# Altium project balenaFin_v1_x_x.PrjPcb (part 2 of 3)

## Sheet 05 - USB.SchDoc
size 420 x 297 mm
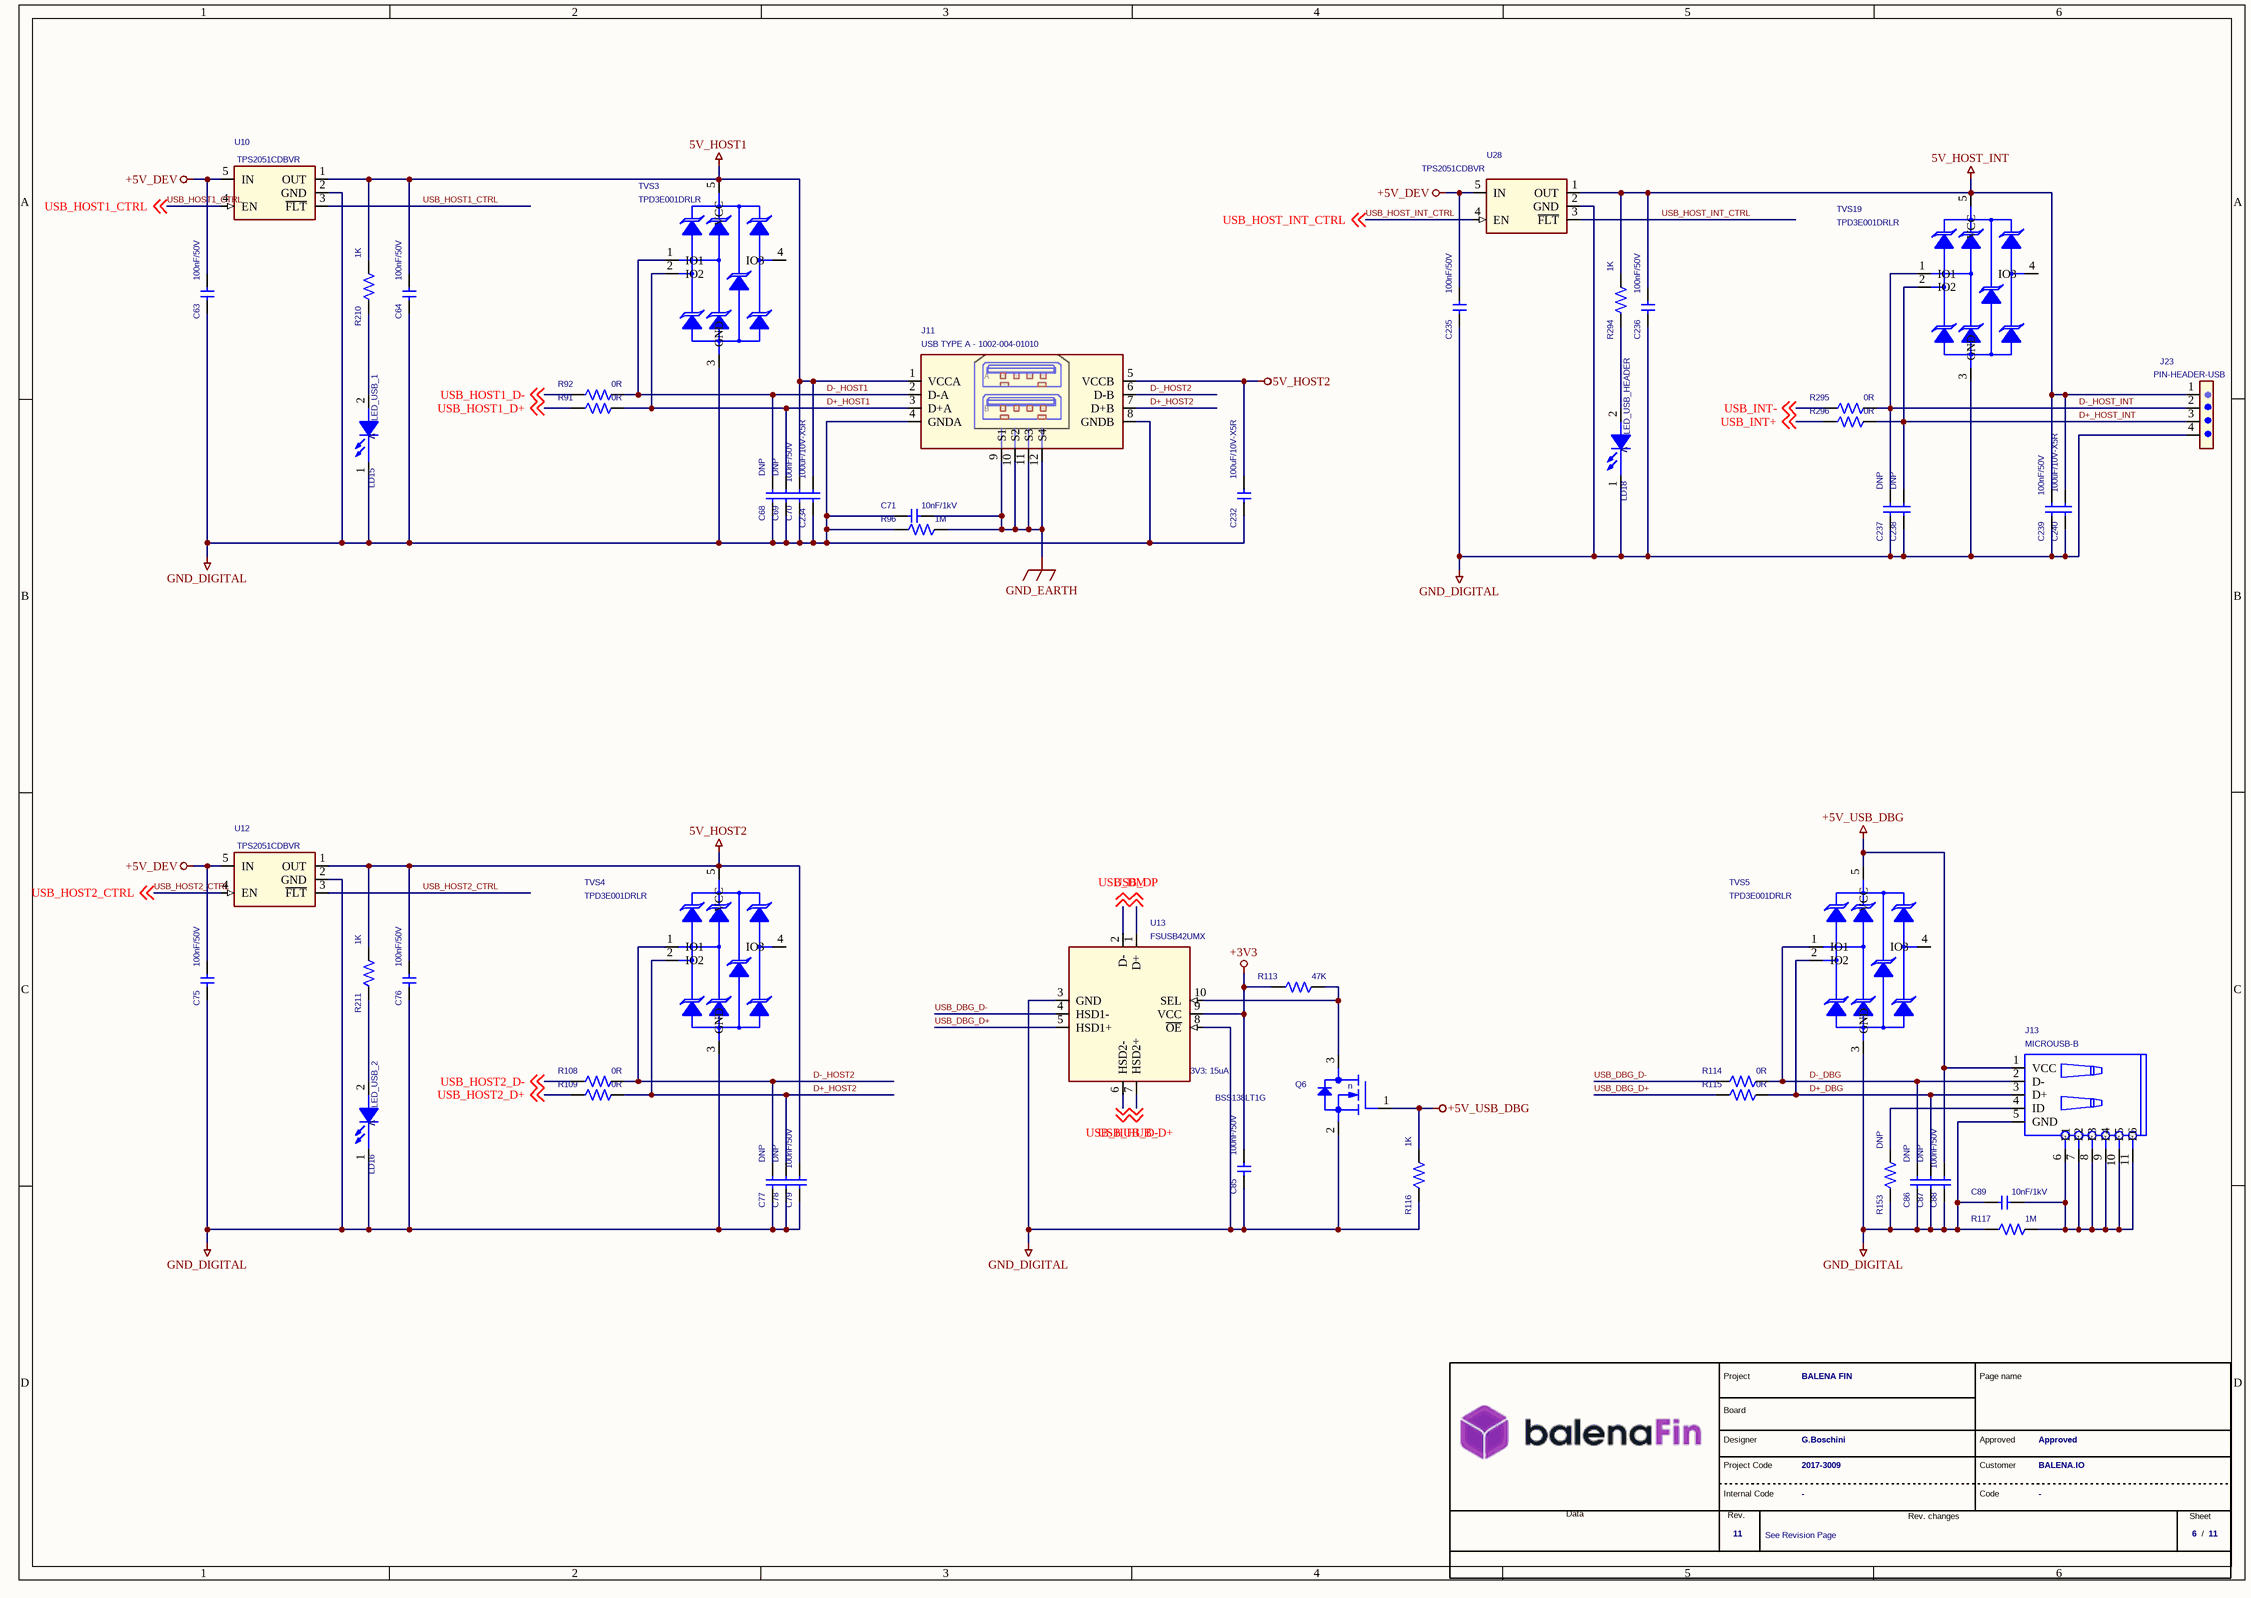
[diagram p7: 05 - USB.SchDoc]

### Parts
(Parts that share a designator on the sheet are numbered #1, #2 ... from top to bottom, then left to right.)
*#5  Revision: 11  FAE RD code: 2017-3009  DocumentoRev: See Revision Page  Page Number: 6  Nome Progetto: BALENA FIN  Customer name: BALENA.IO  Project manager: Approved  Project designer: G.Boschini  (hidden comment: MyFAEVuoto)  (graphical)
C63  100nF/50V  [CS-C-0402]
C64  100nF/50V  [CS-C-0402]
C68  DNP  [CS-C-0402]
C69  DNP  [CS-C-0402]
C70  100nF/50V  [CS-C-0402]
C71  10nF/1kV  [CS-C-1206]
C75  100nF/50V  [CS-C-0402]
C76  100nF/50V  [CS-C-0402]
C77  DNP  [CS-C-0402]
C78  DNP  [CS-C-0402]
C79  100nF/50V  [CS-C-0402]
C85  100nF/50V  [CS-C-0402]
C86  DNP  [CS-C-0402]
C87  DNP  [CS-C-0402]
C88  100nF/50V  [CS-C-0402]
C89  10nF/1kV  [CS-C-1206]
C232  100uF/10V-X5R  [CS-C-1210]
C234  100uF/10V-X5R  [CS-C-1210]
C235  100nF/50V  [CS-C-0402]
C236  100nF/50V  [CS-C-0402]
C237  DNP  [CS-C-0402]
C238  DNP  [CS-C-0402]
C239  100nF/50V  [CS-C-0402]
C240  100uF/10V-X5R  [CS-C-1210]
J11  USB TYPE A - 1002-004-01010  [J-8-0200-FOT-USB-A-2X]
J13  MICROUSB-B  [J-5-0065-FOS-MICROUSB10118192]
J23  PIN-HEADER-USB  [J-4-0254-MDT]
LD15  LED_USB_1  [LD-0603]
LD16  LED_USB_2  [LD-0603]
LD18  LED_USB_HEADER  [LD-0603]
Q6  BSS138LT1G  [SOT23]
R91  0R  [RS-0402]
R92  0R  [RS-0402]
R96  1M  [RS-1206]
R108  0R  [RS-0402]
R109  0R  [RS-0402]
R113  47K  [RS-0402]
R114  0R  [RS-0402]
R115  0R  [RS-0402]
R116  1K  [RS-0402]
R117  1M  [RS-1206]
R153  DNP  [RS-0402]
R210  1K  [RS-0402]
R211  1K  [RS-0402]
R294  1K  [RS-0402]
R295  0R  [RS-0402]
R296  0R  [RS-0402]
TVS3  TPD3E001DRLR  [SOP5_USON6]
TVS4  TPD3E001DRLR  [SOP5_USON6]
TVS5  TPD3E001DRLR  [SOP5_USON6]
TVS19  TPD3E001DRLR  [SOP5_USON6]
U10  TPS2051CDBVR  [SOT23-5]
U12  TPS2051CDBVR  [SOT23-5]
U13  FSUSB42UMX  Power requirements: 3V3: 15uA  [UMLP10]
U28  TPS2051CDBVR  [SOT23-5]

### Nets
5V_HOST1: C64.1 C70.1 C234.1 J11.1(VCCA) R210.2 TVS3.5(VCC) U10.1(OUT)
5V_HOST2: C76.1 C79.1 C232.1 J11.5(VCCB) R211.2 TVS4.5(VCC) U12.1(OUT)
5V_HOST_INT: C236.1 C239.1 C240.1 J23.1 R294.2 TVS19.5(VCC) U28.1(OUT)
+3V3: C85.1 R113.1 U13.9(VCC)
+5V_DEV: C63.1 C75.1 C235.1 U10.5(IN) U12.5(IN) U28.5(IN)
+5V_USB_DBG: C88.1 J13.1(VCC) Q6.1(G) R116.2 TVS5.5(VCC)
GND_DIGITAL: C63.2 C64.2 C68.2 C69.2 C70.2 C71.1 C75.2 C76.2 C77.2 C78.2 C79.2 C85.2 C86.2 C87.2 C88.2 C89.1 C232.2 C234.2 C235.2 C236.2 C237.2 C238.2 C239.2 C240.2 J11.4(GNDA) J11.8(GNDB) J13.5(GND) J23.4 LD15.1(C) LD16.1(C) LD18.1(C) Q6.2(S) R96.1 R116.1 R117.1 R153.1 TVS3.3(GND) TVS4.3(GND) TVS5.3(GND) TVS19.3(GND) U10.2(GND) U12.2(GND) U13.3(GND) U13.8(~{OE}) U28.2(GND)
GND_EARTH: C71.2 J11.9(S1) J11.10(S2) J11.11(S3) J11.12(S4) R96.2
D+_DBG: C87.1 J13.3(D+) R115.2 TVS5.2(IO2)
D+_HOST1: C69.1 J11.3(D+A) R91.2 TVS3.2(IO2)
D+_HOST2: C78.1 J11.7(D+B) R109.2 TVS4.2(IO2)
D+_HOST_INT: C238.1 J23.3 R296.2 TVS19.2(IO2)
D-_DBG: C86.1 J13.2(D-) R114.2 TVS5.1(IO1)
D-_HOST1: C68.1 J11.2(D-A) R92.2 TVS3.1(IO1)
D-_HOST2: C77.1 J11.6(D-B) R108.2 TVS4.1(IO1)
D-_HOST_INT: C237.1 J23.2 R295.2 TVS19.1(IO1)
USB_DBG_D+: R115.1 U13.5(HSD1+)
USB_DBG_D-: R114.1 U13.4(HSD1-)
USB_DM: U13.2(D-) ; off-sheet USB_DM
USB_DP: U13.1(D+) ; off-sheet USB_DP
USB_HOST1_CTRL: U10.3(~{FLT}) U10.4(EN) ; off-sheet USB_HOST1_CTRL
USB_HOST1_D+: R91.1 ; off-sheet USB_HOST1_D+
USB_HOST1_D-: R92.1 ; off-sheet USB_HOST1_D-
USB_HOST2_CTRL: U12.3(~{FLT}) U12.4(EN) ; off-sheet USB_HOST2_CTRL
USB_HOST2_D+: R109.1 ; off-sheet USB_HOST2_D+
USB_HOST2_D-: R108.1 ; off-sheet USB_HOST2_D-
USB_HOST_INT_CTRL: U28.3(~{FLT}) U28.4(EN) ; off-sheet USB_HOST_INT_CTRL
USB_HUB_D+: U13.7(HSD2+) ; off-sheet USB_HUB_D+
USB_HUB_D-: U13.6(HSD2-) ; off-sheet USB_HUB_D-
USB_INT+: R296.1 ; off-sheet USB_INT+
USB_INT-: R295.1 ; off-sheet USB_INT-
NetC89_2: C89.2 J13.6(E1) J13.7(E2) J13.8(E3) J13.9(E4) J13.10(E5) J13.11(E6) R117.2
NetJ13_4: J13.4(ID) R153.2
NetLD15_2: LD15.2(A) R210.1
NetLD16_2: LD16.2(A) R211.1
NetLD18_2: LD18.2(A) R294.1
NetQ6_3: Q6.3(D) R113.2 U13.10(SEL)

Not connected (* = marked no-connect by the designer): TVS3 4(IO3); TVS4 4(IO3); TVS5 4(IO3); TVS19 4(IO3)

### Notes on the sheet
- (in symbol LED V - GENERICO - 0603) V
- (in symbol MyFAEVuoto) Project; Page name; Board; Designer; Project Code; Customer; Internal Code; Code; Data; Rev.; Rev. changes; Sheet; /
- (in symbol NMOS - BSS138 - 0.2A/50V) n
- (in symbol USB - J-8-0200-FOT-USB-A-2X) A; B

### Library data of the parts
C63 C64 C70 C235 C236 C239 = CS-C-0402-100n/16V: CHIP CAP.CER. 100nF 16V 10% X7R 0402; MPN: Generic; Alternative MPN: C0402C104K4RACTU; Room: USB HOST 1; Pkg Type: SMD; Mount: Yes
C68 C69 C237 C238 = CS-C-0402: CHIP CAP.CER. 0402; MPN: Generic; Room: USB HOST 1; Pkg Type: SMD; Mount: No
C71 = CS-C-1206-10n/1kV: CHIP CAP.CER. 10nF 1000V 10% X7R 1206; MPN: Generic; Alternative MPN: GRM31CR73A103KW03L; Room: USB HOST 1; Pkg Type: SMD; Mount: Yes
C75 C76 C79 = CS-C-0402-100n/16V: CHIP CAP.CER. 100nF 16V 10% X7R 0402; MPN: Generic; Alternative MPN: C0402C104K4RACTU; Room: USB HOST 2; Pkg Type: SMD; Mount: Yes
C77 C78 = CS-C-0402: CHIP CAP.CER. 0402; MPN: Generic; Room: USB HOST 2; Pkg Type: SMD; Mount: No
C85 = CS-C-0402-100n/16V: CHIP CAP.CER. 100nF 16V 10% X7R 0402; MPN: Generic; Alternative MPN: C0402C104K4RACTU; Room: SWITCH USB; Pkg Type: SMD; Mount: Yes
C86 C87 = CS-C-0402: CHIP CAP.CER. 0402; MPN: Generic; Room: USB BOOT; Pkg Type: SMD; Mount: No
C88 = CS-C-0402-100n/16V: CHIP CAP.CER. 100nF 16V 10% X7R 0402; MPN: Generic; Alternative MPN: C0402C104K4RACTU; Room: USB BOOT; Pkg Type: SMD; Mount: Yes
C89 = CS-C-1206-10n/1kV: CHIP CAP.CER. 10nF 1000V 10% X7R 1206; MPN: Generic; Alternative MPN: GRM31CR73A103KW03L; Room: USB BOOT; Pkg Type: SMD; Mount: Yes
C232 = CS-C-1210-100u/10V-X5R: CHIP CAP.CER. 100UF 10V 20% X5R 1210; MPN: Generic; Pkg Type: SMD; Room: USB HOST 2; Mount: Yes
C234 C240 = CS-C-1210-100u/10V-X5R: CHIP CAP.CER. 100UF 10V 20% X5R 1210; MPN: Generic; Pkg Type: SMD; Room: USB HOST 1; Mount: Yes
J11 = USB - J-8-0200-FOT-USB-A-2X: USB-A (USB TYPE-A), Stacked USB 2.0 Receptacle Connector 8 Position Through Hole, Right Angle; Alternative MPN: 672983091; Pkg Type: THT; Room: USB HOST 1; Temperature range: -55°..+85°; MPN: 1002-004-01010; Mount: Yes
J13 = USB - MICROUSB-B-FCI10118192: USB - micro B USB 2.0 Receptacle Connector 5 Position Surface Mount, Right Angle; MPN: 10118192-0001LF; Pkg Type: SMD; Note: Full SMD; Room: USB BOOT; Temperature range: -30°..+85°; Mount: Yes
J23 = STRIP-J-4-0254-MDT: CONN HEADER THT 4POS 2.54MM SINGLE ROW; MPN: Generic; Alternative MPN: SL11/112/4/G; Pkg Type: THT; Mount: Yes
LD15 LD18 = LED V - GENERICO - 0603: LED Green 0603 SMT; Alternative MPN: KP-1608SGC; Pkg Type: SMD; Note: V=2.2V/20mA; Room: USB HOST 1; MPN: Generic; Mount: Yes
LD16 = LED V - GENERICO - 0603: LED Green 0603 SMT; Alternative MPN: KP-1608SGC; Pkg Type: SMD; Note: V=2.2V/20mA; Room: USB HOST 2; MPN: Generic; Mount: Yes
Q6 = NMOS - BSS138 - 0.2A/50V: MOSFET N-CH 50V 220MA SOT23-3; Room: SWITCH USB; Pkg Type: SMD; MPN: BSS138LT1G; Mount: Yes
R91 R92 R295 R296 = RS-0402-0r: CHIP RES. 0R 0402 1/16W 1%; MPN: Generic; Room: USB HOST 1; Pkg Type: SMD; Mount: Yes
R96 = RS-1206-1M: CHIP RES. 1M 1206 1/4W 1%; MPN: Generic; Pkg Type: SMD; Room: USB HOST 1; Mount: Yes
R108 R109 = RS-0402-0r: CHIP RES. 0R 0402 1/16W 1%; MPN: Generic; Room: USB HOST 2; Pkg Type: SMD; Mount: Yes
R113 = RS-0402-47k: CHIP RES. 47K 0402 1/16W 1% 100PPM/°C; MPN: Generic; Pkg Type: SMD; Note: 100ppm; Room: SWITCH USB; Mount: Yes
R114 R115 = RS-0402-0r: CHIP RES. 0R 0402 1/16W 1%; MPN: Generic; Room: USB BOOT; Pkg Type: SMD; Mount: Yes
R116 = RS-0402-1k: CHIP RES. 1K 0402 1/16W 1%; MPN: Generic; Pkg Type: SMD; Room: POWER LED; Mount: Yes
R117 = RS-1206-1M: CHIP RES. 1M 1206 1/4W 1%; MPN: Generic; Pkg Type: SMD; Room: USB BOOT; Mount: Yes
R153 = RS-0402: CHIP RES. 0402; MPN: Generic; Pkg Type: SMD; Room: USB BOOT; Mount: No
R210 R294 = RS-0402-1k: CHIP RES. 1K 0402 1/16W 1%; MPN: Generic; Pkg Type: SMD; Room: USB HOST 1; Mount: Yes
R211 = RS-0402-1k: CHIP RES. 1K 0402 1/16W 1%; MPN: Generic; Pkg Type: SMD; Room: USB HOST 2; Mount: Yes
TVS3 = TVS-UNI3x - TPD3E001DRLR - USB: TVS DIODE 5.5VWM; Alternative MPN: TPD3E001DRYR; Note: Unidirectional - High-Speed Data Interface - USB; Pkg Type: SMD; Room: USB HOST 1; Temperature range: -40°..+85°; MPN: TPD3E001DRLR; Mount: Yes
TVS4 = TVS-UNI3x - TPD3E001DRLR - USB: TVS DIODE 5.5VWM; Note: Unidirectional - High-Speed Data Interface - USB; Pkg Type: SMD; Room: USB HOST 2; Temperature range: -40°..+85°; MPN: TPD3E001DRLR; Mount: Yes
TVS5 = TVS-UNI3x - TPD3E001DRLR - USB: TVS DIODE 5.5VWM; Note: Unidirectional - High-Speed Data Interface - USB; Pkg Type: SMD; Room: USB BOOT; Temperature range: -40°..+85°; MPN: TPD3E001DRLR; Mount: Yes
TVS19 = TVS-UNI3x - TPD3E001DRLR - USB: TVS DIODE 5.5VWM; Note: Unidirectional - High-Speed Data Interface - USB; Pkg Type: SMD; Room: USB HOST 1; Temperature range: -40°..+85°; MPN: TPD3E001DRLR; Mount: Yes
U10 U28 = USB-PSW - TPS2051CDBVR: Power Switch/Driver 1:1 N-Channel 500mA SOT-23-5; Room: USB HOST 1; Pkg Type: SMD; Note: Active High EN; Temperature range: -40°..+125°; MPN: TPS2051CDBVR; Mount: Yes
U12 = USB-PSW - TPS2051CDBVR: Power Switch/Driver 1:1 N-Channel 500mA SOT-23-5; Room: USB HOST 2; Pkg Type: SMD; Note: Active High EN; Temperature range: -40°..+125°; MPN: TPS2051CDBVR; Mount: Yes
U13 = SWITCH-USB - FSUSB42UMX: USB Switch IC 1 Channel 10-UMLP (1.8x1.4); Room: SWITCH USB; Pkg Type: SMD; Temperature range: -40°..+85°; MPN: FSUSB42UMX; Mount: Yes
*#5 = MyFAEVuoto: Page Count: 11; Customer Code: -; Database: -

## Sheet 06 - MCU.SchDoc
size 420 x 297 mm
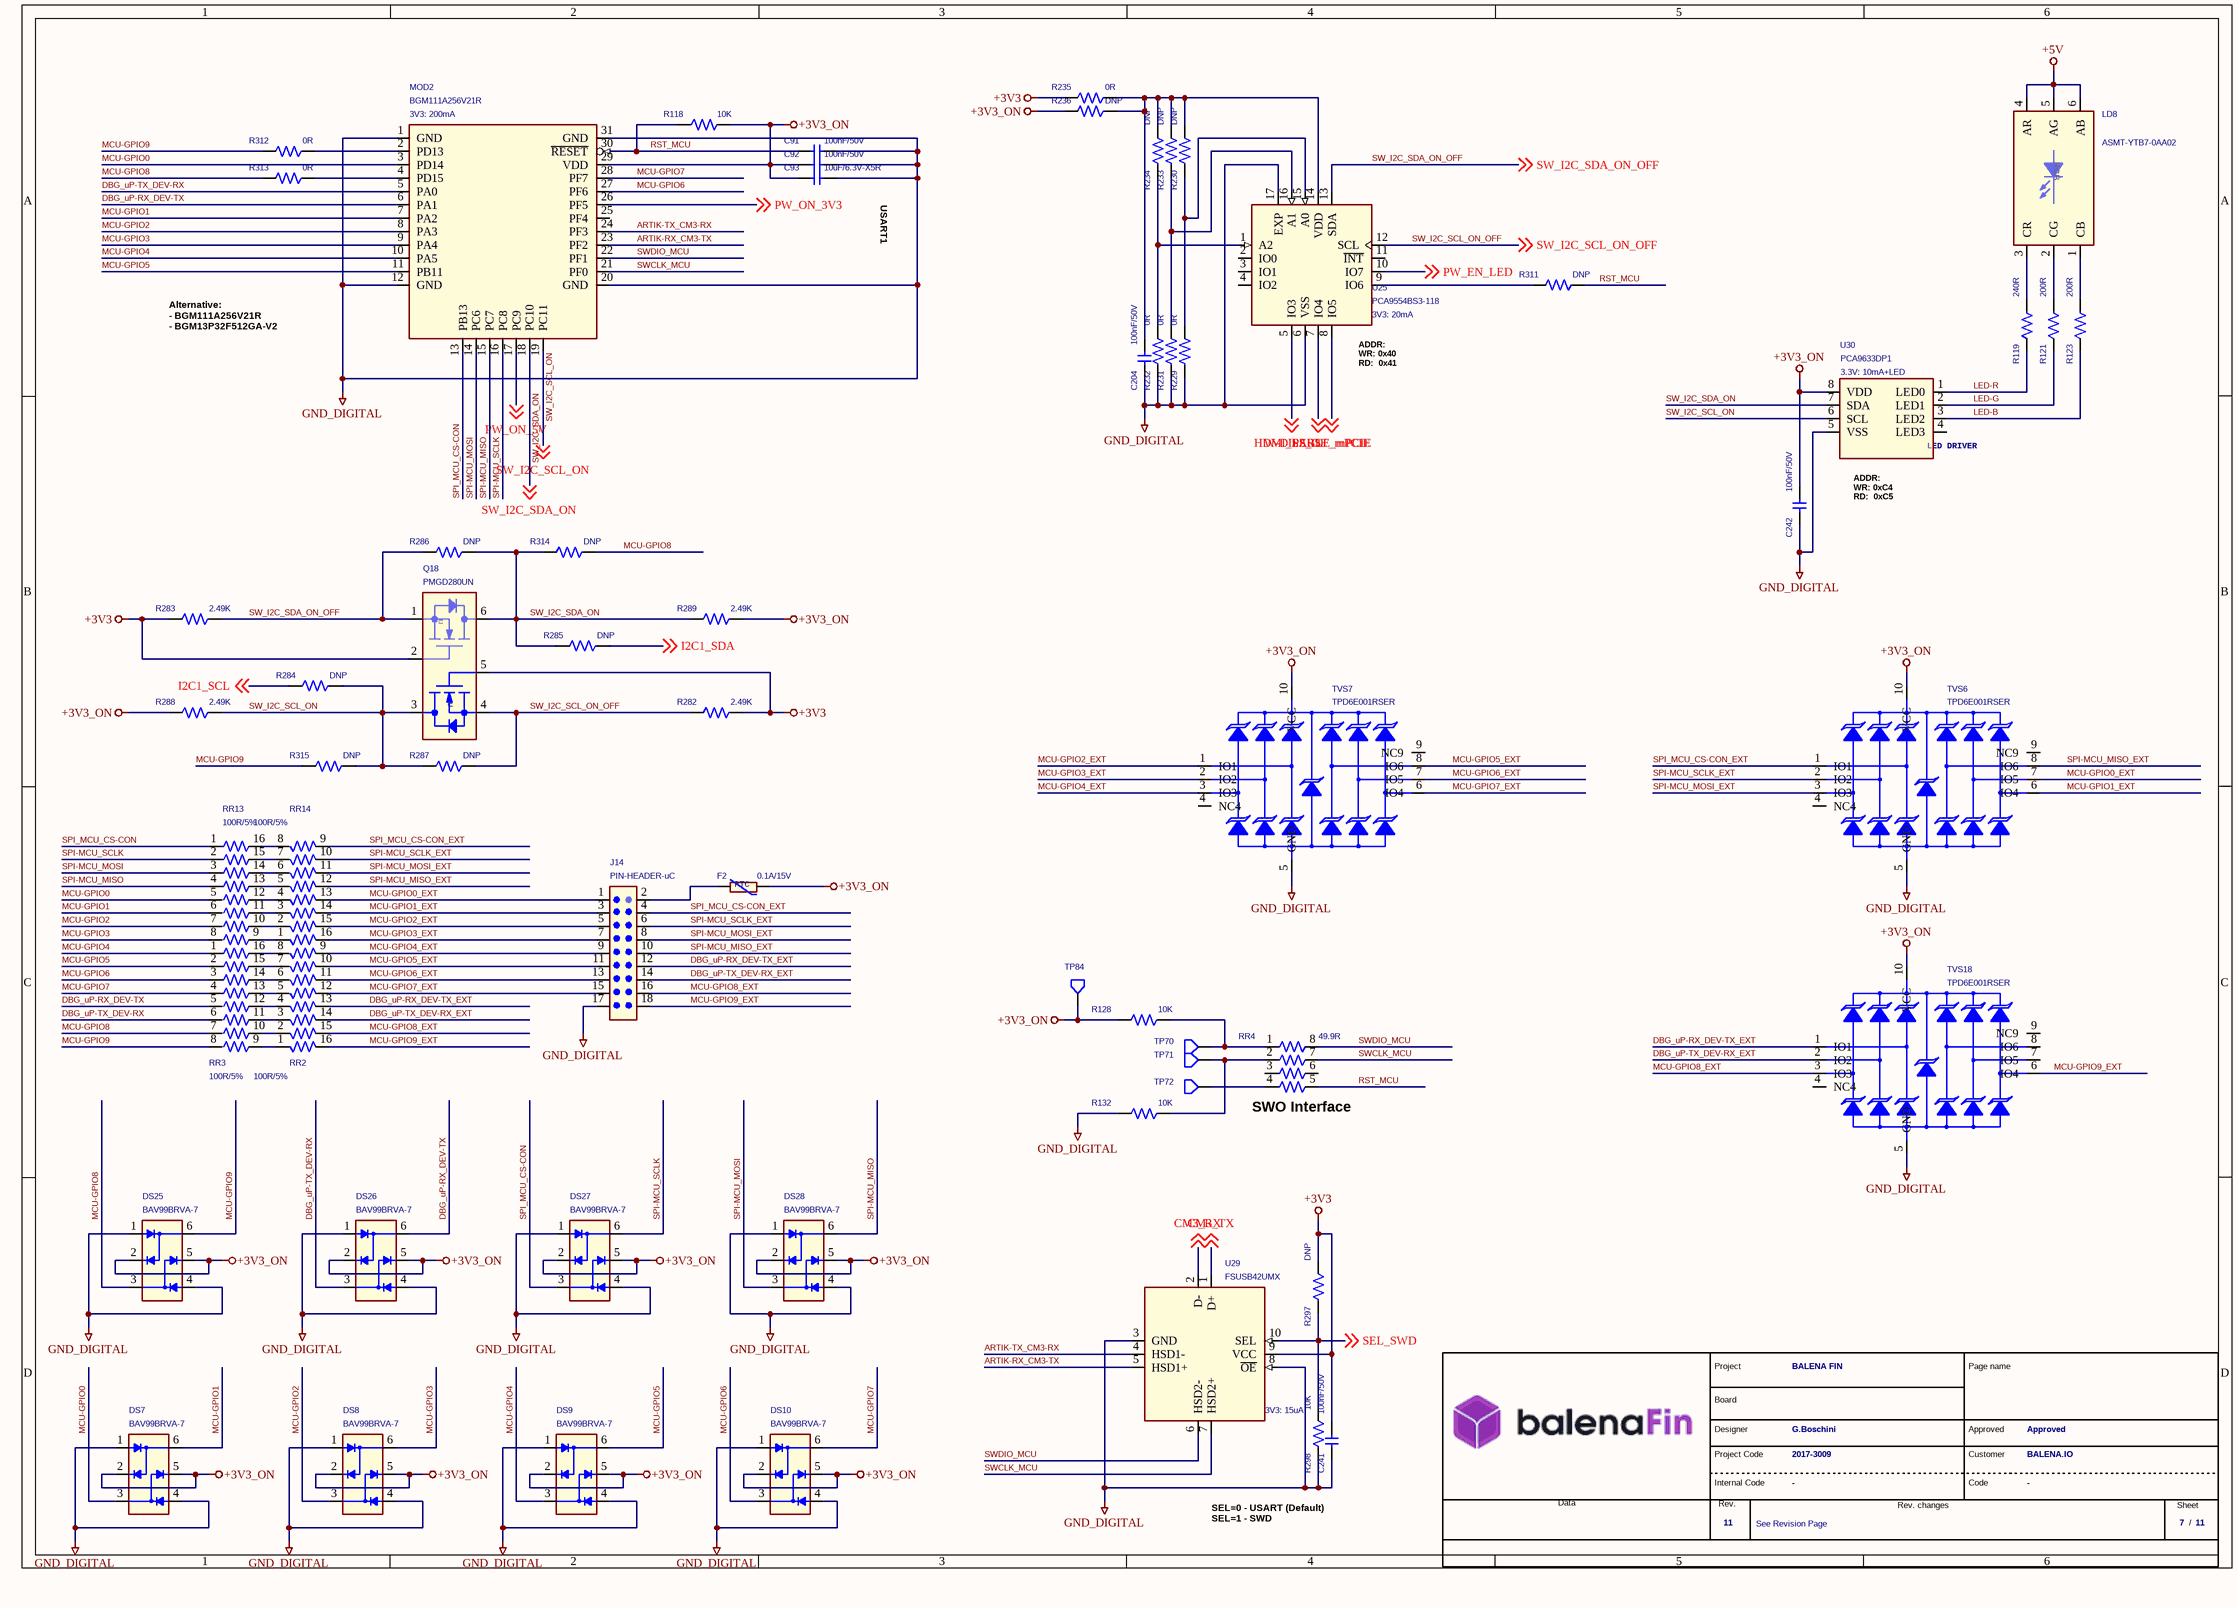
[diagram p8: 06 - MCU.SchDoc]

### Parts
(Parts that share a designator on the sheet are numbered #1, #2 ... from top to bottom, then left to right.)
*#6  Revision: 11  FAE RD code: 2017-3009  DocumentoRev: See Revision Page  Page Number: 7  Nome Progetto: BALENA FIN  Customer name: BALENA.IO  Project manager: Approved  Project designer: G.Boschini  (hidden comment: MyFAEVuoto)  (graphical)
C91  100nF/50V  [CS-C-0402]
C92  100nF/50V  [CS-C-0402]
C93  10uF/6.3V-X5R  [CS-C-0402]
C204  100nF/50V  [CS-C-0402]
C241  100nF/50V  [CS-C-0402]
C242  100nF/50V  [CS-C-0402]
DS7  BAV99BRVA-7  [SOT563]
DS8  BAV99BRVA-7  [SOT563]
DS9  BAV99BRVA-7  [SOT563]
DS10  BAV99BRVA-7  [SOT563]
DS25  BAV99BRVA-7  [SOT563]
DS26  BAV99BRVA-7  [SOT563]
DS27  BAV99BRVA-7  [SOT563]
DS28  BAV99BRVA-7  [SOT563]
F2  0.1A/15V  [FS-0603]
J14  PIN-HEADER-uC  [J-9X2-0254-MDT]
LD8  ASMT-YTB7-0AA02  [LD-PLCC6-GUIDAVLP]
MOD2  BGM111A256V21R  Power requirements: 3V3: 200mA  [MOD-ARTIK-020]
Q18  PMGD280UN  [SOT363]
R118  10K  [RS-0402]
R119  240R  [RS-0402]
R121  200R  [RS-0402]
R123  200R  [RS-0402]
R128  10K  [RS-0402]
R132  10K  [RS-0402]
R229  0R  [RS-0402]
R230  DNP  [RS-0402]
R231  0R  [RS-0402]
R232  0R  [RS-0402]
R233  DNP  [RS-0402]
R234  DNP  [RS-0402]
R235  0R  [RS-0402]
R236  DNP  [RS-0402]
R282  2.49K  [RS-0402]
R283  2.49K  [RS-0402]
R284  DNP  [RS-0402]
R285  DNP  [RS-0402]
R286  DNP  [RS-0402]
R287  DNP  [RS-0402]
R288  2.49K  [RS-0402]
R289  2.49K  [RS-0402]
R297  DNP  [RS-0402]
R298  10K  [RS-0402]
R311  DNP  [RS-0402]
R312  0R  [RS-0402]
R313  0R  [RS-0402]
R314  DNP  [RS-0402]
R315  DNP  [RS-0402]
RR2  100R/5%  [RR-8X-1506]
RR3  100R/5%  [RR-8X-1506]
RR4  49.9R  [RR-1206]
RR13  100R/5%  [RR-8X-1506]
RR14  100R/5%  [RR-8X-1506]
TP70  TPS  [TPS-0100]  (value not drawn)  (no BOM)
TP71  TPS  [TPS-0100]  (value not drawn)  (no BOM)
TP72  TPS  [TPS-0100]  (value not drawn)  (no BOM)
TP84  TPS  [TPS-0100]  (value not drawn)  (no BOM)
TVS6  TPD6E001RSER  [UFQFN10]
TVS7  TPD6E001RSER  [UFQFN10]
TVS18  TPD6E001RSER  [UFQFN10]
U25  PCA9554BS3-118  Power requirements: 3V3: 20mA  [QFN16-EXP-3X3-4X4]
U29  FSUSB42UMX  Power requirements: 3V3: 15uA  [UMLP10]
U30  PCA9633DP1  Power requirements: 3.3V: 10mA+LED  [MSOP8]

### Nets
+3V3: C241.1 Q18.2(G1) Q18.5(G2) R235.2 R282.1 R283.2 R297.2 U29.9(VCC)
+3V3_ON: C92.1 C93.1 C242.1 DS7.2(C1) DS7.5(C2) DS8.2(C1) DS8.5(C2) DS9.2(C1) DS9.5(C2) DS10.2(C1) DS10.5(C2) DS25.2(C1) DS25.5(C2) DS26.2(C1) DS26.5(C2) DS27.2(C1) DS27.5(C2) DS28.2(C1) DS28.5(C2) F2.2 MOD2.29(VDD) R118.2 R128.2 R236.2 R288.2 R289.1 TP84.1(TP) TVS6.10(VCC) TVS7.10(VCC) TVS18.10(VCC) U30.8(VDD)
+5V: LD8.4(AR) LD8.5(AG) LD8.6(AB)
GND_DIGITAL: C91.2 C92.2 C93.2 C204.2 C241.2 C242.2 DS7.1(A1) DS7.4(A2) DS8.1(A1) DS8.4(A2) DS9.1(A1) DS9.4(A2) DS10.1(A1) DS10.4(A2) DS25.1(A1) DS25.4(A2) DS26.1(A1) DS26.4(A2) DS27.1(A1) DS27.4(A2) DS28.1(A1) DS28.4(A2) J14.17 MOD2.1(GND) MOD2.12(GND) MOD2.20(GND) MOD2.31(GND) R132.2 R229.1 R231.1 R232.1 R298.1 TVS6.5(GND) TVS7.5(GND) TVS18.5(GND) U25.6(VSS) U25.17(EXP) U29.3(GND) U29.8(~{OE}) U30.5(VSS)
ARTIK-RX_CM3-TX: MOD2.23(PF2) U29.5(HSD1+)
ARTIK-TX_CM3-RX: MOD2.24(PF3) U29.4(HSD1-)
CM3_RX: U29.2(D-) ; off-sheet CM3_RX
CM3_TX: U29.1(D+) ; off-sheet CM3_TX
DBG_uP-RX_DEV-TX: DS26.6(AC1) MOD2.6(PA1) RR3.5
DBG_uP-RX_DEV-TX_EXT: J14.12 RR2.13 TVS18.1(IO1)
DBG_uP-TX_DEV-RX: DS26.3(AC2) MOD2.5(PA0) RR3.6
DBG_uP-TX_DEV-RX_EXT: J14.14 RR2.14 TVS18.2(IO2)
HDMI_LS_OE: U25.5(IO3) ; off-sheet HDMI_LS_OE
I2C1_SCL: R284.2 ; off-sheet I2C1_SCL
I2C1_SDA: R285.1 ; off-sheet I2C1_SDA
LED-B: R123.2 U30.3(LED2)
LED-G: R121.2 U30.2(LED1)
LED-R: R119.2 U30.1(LED0)
MCU-GPIO0: DS7.3(AC2) MOD2.3(PD14) RR13.5
MCU-GPIO0_EXT: J14.1 RR14.13 TVS6.7(IO5)
MCU-GPIO1: DS7.6(AC1) MOD2.7(PA2) RR13.6
MCU-GPIO1_EXT: J14.3 RR14.14 TVS6.6(IO4)
MCU-GPIO2: DS8.3(AC2) MOD2.8(PA3) RR13.7
MCU-GPIO2_EXT: J14.5 RR14.15 TVS7.1(IO1)
MCU-GPIO3: DS8.6(AC1) MOD2.9(PA4) RR13.8
MCU-GPIO3_EXT: J14.7 RR14.16 TVS7.2(IO2)
MCU-GPIO4: DS9.3(AC2) MOD2.10(PA5) RR3.1
MCU-GPIO4_EXT: J14.9 RR2.9 TVS7.3(IO3)
MCU-GPIO5: DS9.6(AC1) MOD2.11(PB11) RR3.2
MCU-GPIO5_EXT: J14.11 RR2.10 TVS7.8(IO6)
MCU-GPIO6: DS10.3(AC2) MOD2.27(PF6) RR3.3
MCU-GPIO6_EXT: J14.13 RR2.11 TVS7.7(IO5)
MCU-GPIO7: DS10.6(AC1) MOD2.28(PF7) RR3.4
MCU-GPIO7_EXT: J14.15 RR2.12 TVS7.6(IO4)
MCU-GPIO8: DS25.3(AC2) R313.2 R314.1 RR3.7
MCU-GPIO8_EXT: J14.16 RR2.15 TVS18.3(IO3)
MCU-GPIO9: DS25.6(AC1) R312.2 R315.2 RR3.8
MCU-GPIO9_EXT: J14.18 RR2.16 TVS18.6(IO4)
PERST_mPCIE: U25.8(IO5) ; off-sheet PERST_mPCIE
PW_EN_LED: U25.10(IO7) ; off-sheet PW_EN_LED
PW_ON_3V3: MOD2.26(PF5) ; off-sheet PW_ON_3V3
PW_ON_5V: MOD2.17(PC9) ; off-sheet PW_ON_5V
RST_MCU: C91.1 MOD2.30(~{RESET}) R118.1 R311.1 RR4.5
SEL_SWD: R297.1 R298.2 U29.10(SEL) ; off-sheet SEL_SWD
SPI-MCU_MISO: DS28.6(AC1) MOD2.15(PC7) RR13.4
SPI-MCU_MISO_EXT: J14.10 RR14.12 TVS6.8(IO6)
SPI-MCU_MOSI: DS28.3(AC2) MOD2.14(PC6) RR13.3
SPI-MCU_MOSI_EXT: J14.8 RR14.11 TVS6.3(IO3)
SPI-MCU_SCLK: DS27.6(AC1) MOD2.16(PC8) RR13.2
SPI-MCU_SCLK_EXT: J14.6 RR14.10 TVS6.2(IO2)
SPI_MCU_CS-CON: DS27.3(AC2) MOD2.13(PB13) RR13.1
SPI_MCU_CS-CON_EXT: J14.4 RR14.9 TVS6.1(IO1)
SW_I2C_SCL_ON: MOD2.19(PC11) Q18.3(D2) R284.1 R287.2 R288.1 R315.1 U30.6(SCL) ; off-sheet SW_I2C_SCL_ON
SW_I2C_SCL_ON_OFF: Q18.4(S2) R282.2 R287.1 U25.12(SCL) ; off-sheet SW_I2C_SCL_ON_OFF
SW_I2C_SDA_ON: MOD2.18(PC10) Q18.6(D1) R285.2 R286.1 R289.2 R314.2 U30.7(SDA) ; off-sheet SW_I2C_SDA_ON
SW_I2C_SDA_ON_OFF: Q18.1(S1) R283.1 R286.2 U25.13(SDA) ; off-sheet SW_I2C_SDA_ON_OFF
SWCLK_MCU: MOD2.21(PF0) RR4.7 U29.7(HSD2+)
SWDIO_MCU: MOD2.22(PF1) RR4.8 U29.6(HSD2-)
W-DISABLE_mPCIE: U25.7(IO4) ; off-sheet W-DISABLE_mPCIE
NetC204_1: C204.1 R230.2 R233.2 R234.2 R235.1 R236.1 U25.14(VDD)
NetF2_1: F2.1 J14.2
NetLD8_1: LD8.1(CB) R123.1
NetLD8_2: LD8.2(CG) R121.1
NetLD8_3: LD8.3(CR) R119.1
NetMOD2_2: MOD2.2(PD13) R312.1
NetMOD2_4: MOD2.4(PD15) R313.1
NetR128_1: R128.1 RR4.1 TP70.1(TP)
NetR132_1: R132.1 RR4.2 TP71.1(TP)
NetR229_2: R229.2 R230.1 U25.15(A0)
NetR231_2: R231.2 R233.1 U25.16(A1)
NetR232_2: R232.2 R234.1 U25.1(A2)
NetR311_2: R311.2 U25.9(IO6)
NetRR2_1: RR2.1 RR3.9
NetRR2_2: RR2.2 RR3.10
NetRR2_3: RR2.3 RR3.11
NetRR2_4: RR2.4 RR3.12
NetRR2_5: RR2.5 RR3.13
NetRR2_6: RR2.6 RR3.14
NetRR2_7: RR2.7 RR3.15
NetRR2_8: RR2.8 RR3.16
NetRR4_4: RR4.4 TP72.1(TP)
NetRR13_9: RR13.9 RR14.1
NetRR13_10: RR13.10 RR14.2
NetRR13_11: RR13.11 RR14.3
NetRR13_12: RR13.12 RR14.4
NetRR13_13: RR13.13 RR14.5
NetRR13_14: RR13.14 RR14.6
NetRR13_15: RR13.15 RR14.7
NetRR13_16: RR13.16 RR14.8

Not connected (* = marked no-connect by the designer): MOD2 25(PF4); RR4 3 6; TVS6 4(NC4) 9(NC9); TVS7 4(NC4) 9(NC9); TVS18 4(NC4) 7(IO5) 8(IO6) 9(NC9); U25 2(IO0) 3(IO1) 4(IO2) 11(~{INT}); U30 4(LED3)

### Notes on the sheet
- USART1
- Alternative:
  - BGM111A256V21R
  - BGM13P32F512GA-V2
- (near U25) ADDR:
  WR: 0x40
  RD:  0x41
- ADDR:
  WR: 0xC4
  RD:  0xC5
- (near RR4) SWO Interface
- SEL=0 - USART (Default)
  SEL=1 - SWD
- (in symbol LED DRIVER-4x - PCA9633DP1) LED DRIVER
- (in symbol LED RGB - ASMT-YTB7-0AA02) RGB
- (in symbol MyFAEVuoto) Project; Page name; Board; Designer; Project Code; Customer; Internal Code; Code; Data; Rev.; Rev. changes; Sheet; /
- (in symbol NMOS-2X - PMGD280UN - 0.87A/20V) n
- (in symbol PTC - 0ZCM0010FF2G - 0.1A/15V) PTC

### Library data of the parts
C91 C92 = CS-C-0402-100n/16V: CHIP CAP.CER. 100nF 16V 10% X7R 0402; MPN: Generic; Alternative MPN: C0402C104K4RACTU; Room: ARTIK 020; Pkg Type: SMD; Mount: Yes
C93 = CS-C-0402-10u/6V3-X5R: CHIP CAP.CER. 10uF 6.3V 20% X5R 0402; MPN: Generic; Alternative MPN: CC0402MRX5R5BB106; Pkg Type: SMD; Room: ARTIK 020; Temperature range: -55°..+85°; Mount: Yes
C204 = CS-C-0402-100n/16V: CHIP CAP.CER. 100nF 16V 10% X7R 0402; MPN: Generic; Alternative MPN: C0402C104K4RACTU; Room: IO-EXPANDER; Pkg Type: SMD; Mount: Yes
C241 = CS-C-0402-100n/16V: as C85 on sheet 05 - USB; Mount: Yes
C242 = CS-C-0402-100n/16V: CHIP CAP.CER. 100nF 16V 10% X7R 0402; MPN: Generic; Alternative MPN: C0402C104K4RACTU; Room: SWITCH-PW-3V3; Pkg Type: SMD; Mount: Yes
DS7-DS10 DS25-DS28 = DIODO4x - BAV99BRVA-7 -0.2A/75V: Diode Switching 75V 0.215A 6-Pin SOT-563 T/R; Room: MCU CONNECTOR; Note: 2x Serie; Pkg Type: SMD; Temperature range: -65°..+150°; MPN: BAV99BRVA-7; Mount: Yes
F2 = PTC - 0ZCM0010FF2G - 0.1A/15V: PTC RESET FUSE 15V 100MA 0603; Pkg Type: SMD; Note: Ihold=250mA; Room: MCU CONNECTOR; Temperature range: -40°..+85°; MPN: 0ZCM0010FF2G; Mount: Yes
J14 = STRIP-J-9X2-0254-MDT: CONN HEADER THT 18POS 2.54MM DUAL ROW; MPN: Generic; Room: MCU CONNECTOR; Pkg Type: THT; Mount: Yes
LD8 = LED RGB - ASMT-YTB7-0AA02: LED RGB- 623nm Red, 529nm Green, PLCC6 469nm Blue LED Indication -  Discrete 2.1V Red, 3.1V; Room: LED RGB; Note: VFR=2.1V@20mA - VFG=VFB=3.1V@20mA; Pkg Type: SMD; MPN: ASMT-YTB7-0AA02; Mount: Yes
MOD2 = ARTIK - 020: Bluetooth v4.2 Transceiver Module 2.4GHz Integrated, Chip Surface Mount; Note: PU_GPIO=100k - VIH=VDDx0.7 - VIL=VDDx0.3 - VOH=VDDx0.6 - VOL=VDDx0.4; Pkg Type: SMD; Room: ARTIK 020; Temperature range: -40°..+85°; MPN: BGM111A256V21R; Mount: Yes
Q18 = NMOS-2X - PMGD280UN - 0.87A/20V: MOSFET 2N-CH 20V 0.87A 6TSSOP; Pkg Type: SMD; Note: Vth=0.7V - Rds=0.4ohm; Room: I2C-ISOLATOR; Temperature range: -55°..+150°; MPN: PMGD280UN; Mount: Yes
R118 = RS-0402-10k: CHIP RES. 10K 0402 1/16W 1%; MPN: Generic; Room: ARTIK 020; Pkg Type: SMD; Temperature range: -55°..+125°; Mount: Yes
R119 = RS-0402-240r: CHIP RES. 240R 0402 1/16W 1% 100PPM/°C; MPN: Generic; Pkg Type: SMD; Note: 100ppm; Room: LED RGB; Temperature range: -55°..+125°; Mount: Yes
R121 R123 = RS-0402-200r: CHIP RES. 200R 0402 1/16W 1% 100PPM/°C; MPN: Generic; Pkg Type: SMD; Note: 100ppm; Room: LED RGB; Mount: Yes
R128 R132 = RS-0402-10k: CHIP RES. 10K 0402 1/16W 1%; MPN: Generic; Room: SWO MCU; Pkg Type: SMD; Temperature range: -55°..+125°; Mount: Yes
R229 R231 R232 R235 R312 R313 = RS-0402-0r: CHIP RES. 0R 0402 1/16W 1%; MPN: Generic; Room: IO-EXPANDER; Pkg Type: SMD; Mount: Yes
R230 R233 R234 R236 = RS-0402: CHIP RES. 0402; MPN: Generic; Pkg Type: SMD; Room: IO-EXPANDER; Mount: No
R282 R283 R288 R289 = RS-0402-2.49k: CHIP RES. 2K49 0402 1/16W 1% 100PPM/°C; MPN: Generic; Room: I2C-ISOLATOR; Note: 100ppm; Pkg Type: SMD; Mount: Yes
R284 R285 R314 R315 = RS-0402: CHIP RES. 0402; MPN: Generic; Pkg Type: SMD; Room: I2C-ISOLATOR; Mount: No
R286 R287 = RS-0402: CHIP RES. 0R 0402 1/10W 1%; MPN: Generic; Pkg Type: SMD; Room: I2C-ISOLATOR; Mount: No
R297 = RS-0402: CHIP RES. 0402; MPN: Generic; Pkg Type: SMD; Mount: No
R298 = RS-0402-10k: CHIP RES. 10K 0402 1/16W 1%; MPN: Generic; Pkg Type: SMD; Temperature range: -55°..+125°; Mount: Yes
R311 = RS-0402-0r: CHIP RES. 0R 0402 1/16W 1%; MPN: Generic; Room: I2C-ISOLATOR; Pkg Type: SMD; Mount: No
RR2 RR3 RR13 RR14 = RR-8X-1506-100r/5%: RES ARRAY 8 RES 100 OHM 1506 5%; MPN: Generic; Alternative MPN: CAY16-101J8LF; Room: MCU CONNECTOR; Note: 200ppm; Pkg Type: SMD; Temperature range: -55°..+125°; Mount: Yes
RR4 = RR-1206-49.9r: RES ARRAY 4 RES 49.9 OHM 1206 1%; MPN: Generic; Alternative MPN: CAY16-49R9F4LF; Note: 4x; Pkg Type: SMD; Room: SWO MCU; Mount: Yes
TP70-TP72 TP84 = TEST POINT SMD 1 MM: TEST POINT SMD; MPN: TP-No-BoM; Pkg Type: SMD; Mount: Yes
TVS6 TVS7 TVS18 = TVS-UNI6x - TPD6E001RSER: TVS DIODE 5VWM; Room: MCU CONNECTOR; Pkg Type: SMD; Note: Unidirectional - 6x - High-Speed Data Interface  I/O; Temperature range: -40°..+85°; MPN: TPD6E001RSER; Mount: Yes
U25 = IO EXP-8b - PCA9554BS3-118: IC I/O EXPANDER I2C 8B 16HVQFN; Alternative MPN: PCA9554ABS; Room: IO-EXPANDER; Note: Full Bidirectional; Pkg Type: SMD; Temperature range: -40°..+85°; MPN: PCA9554BS3-118; Mount: Yes
U29 = SWITCH-USB - FSUSB42UMX: as U13 on sheet 05 - USB; Temperature range: -40°..+85°; MPN: FSUSB42UMX; Mount: Yes
U30 = LED DRIVER-4x - PCA9633DP1: IC LED DRIVER PS DIM 25MA 8TSSOP; Note: VCC=2.3V-5.5V - VIH-I2C=0.7*VDD-5.5V; Pkg Type: SMD; Temperature range: -40°..+85°; MPN: PCA9633DP1; Mount: Yes
*#6 = MyFAEVuoto: Page Count: 11; Customer Code: -; Database: -

## Sheet 07 - eMMC.SchDoc
size 420 x 297 mm
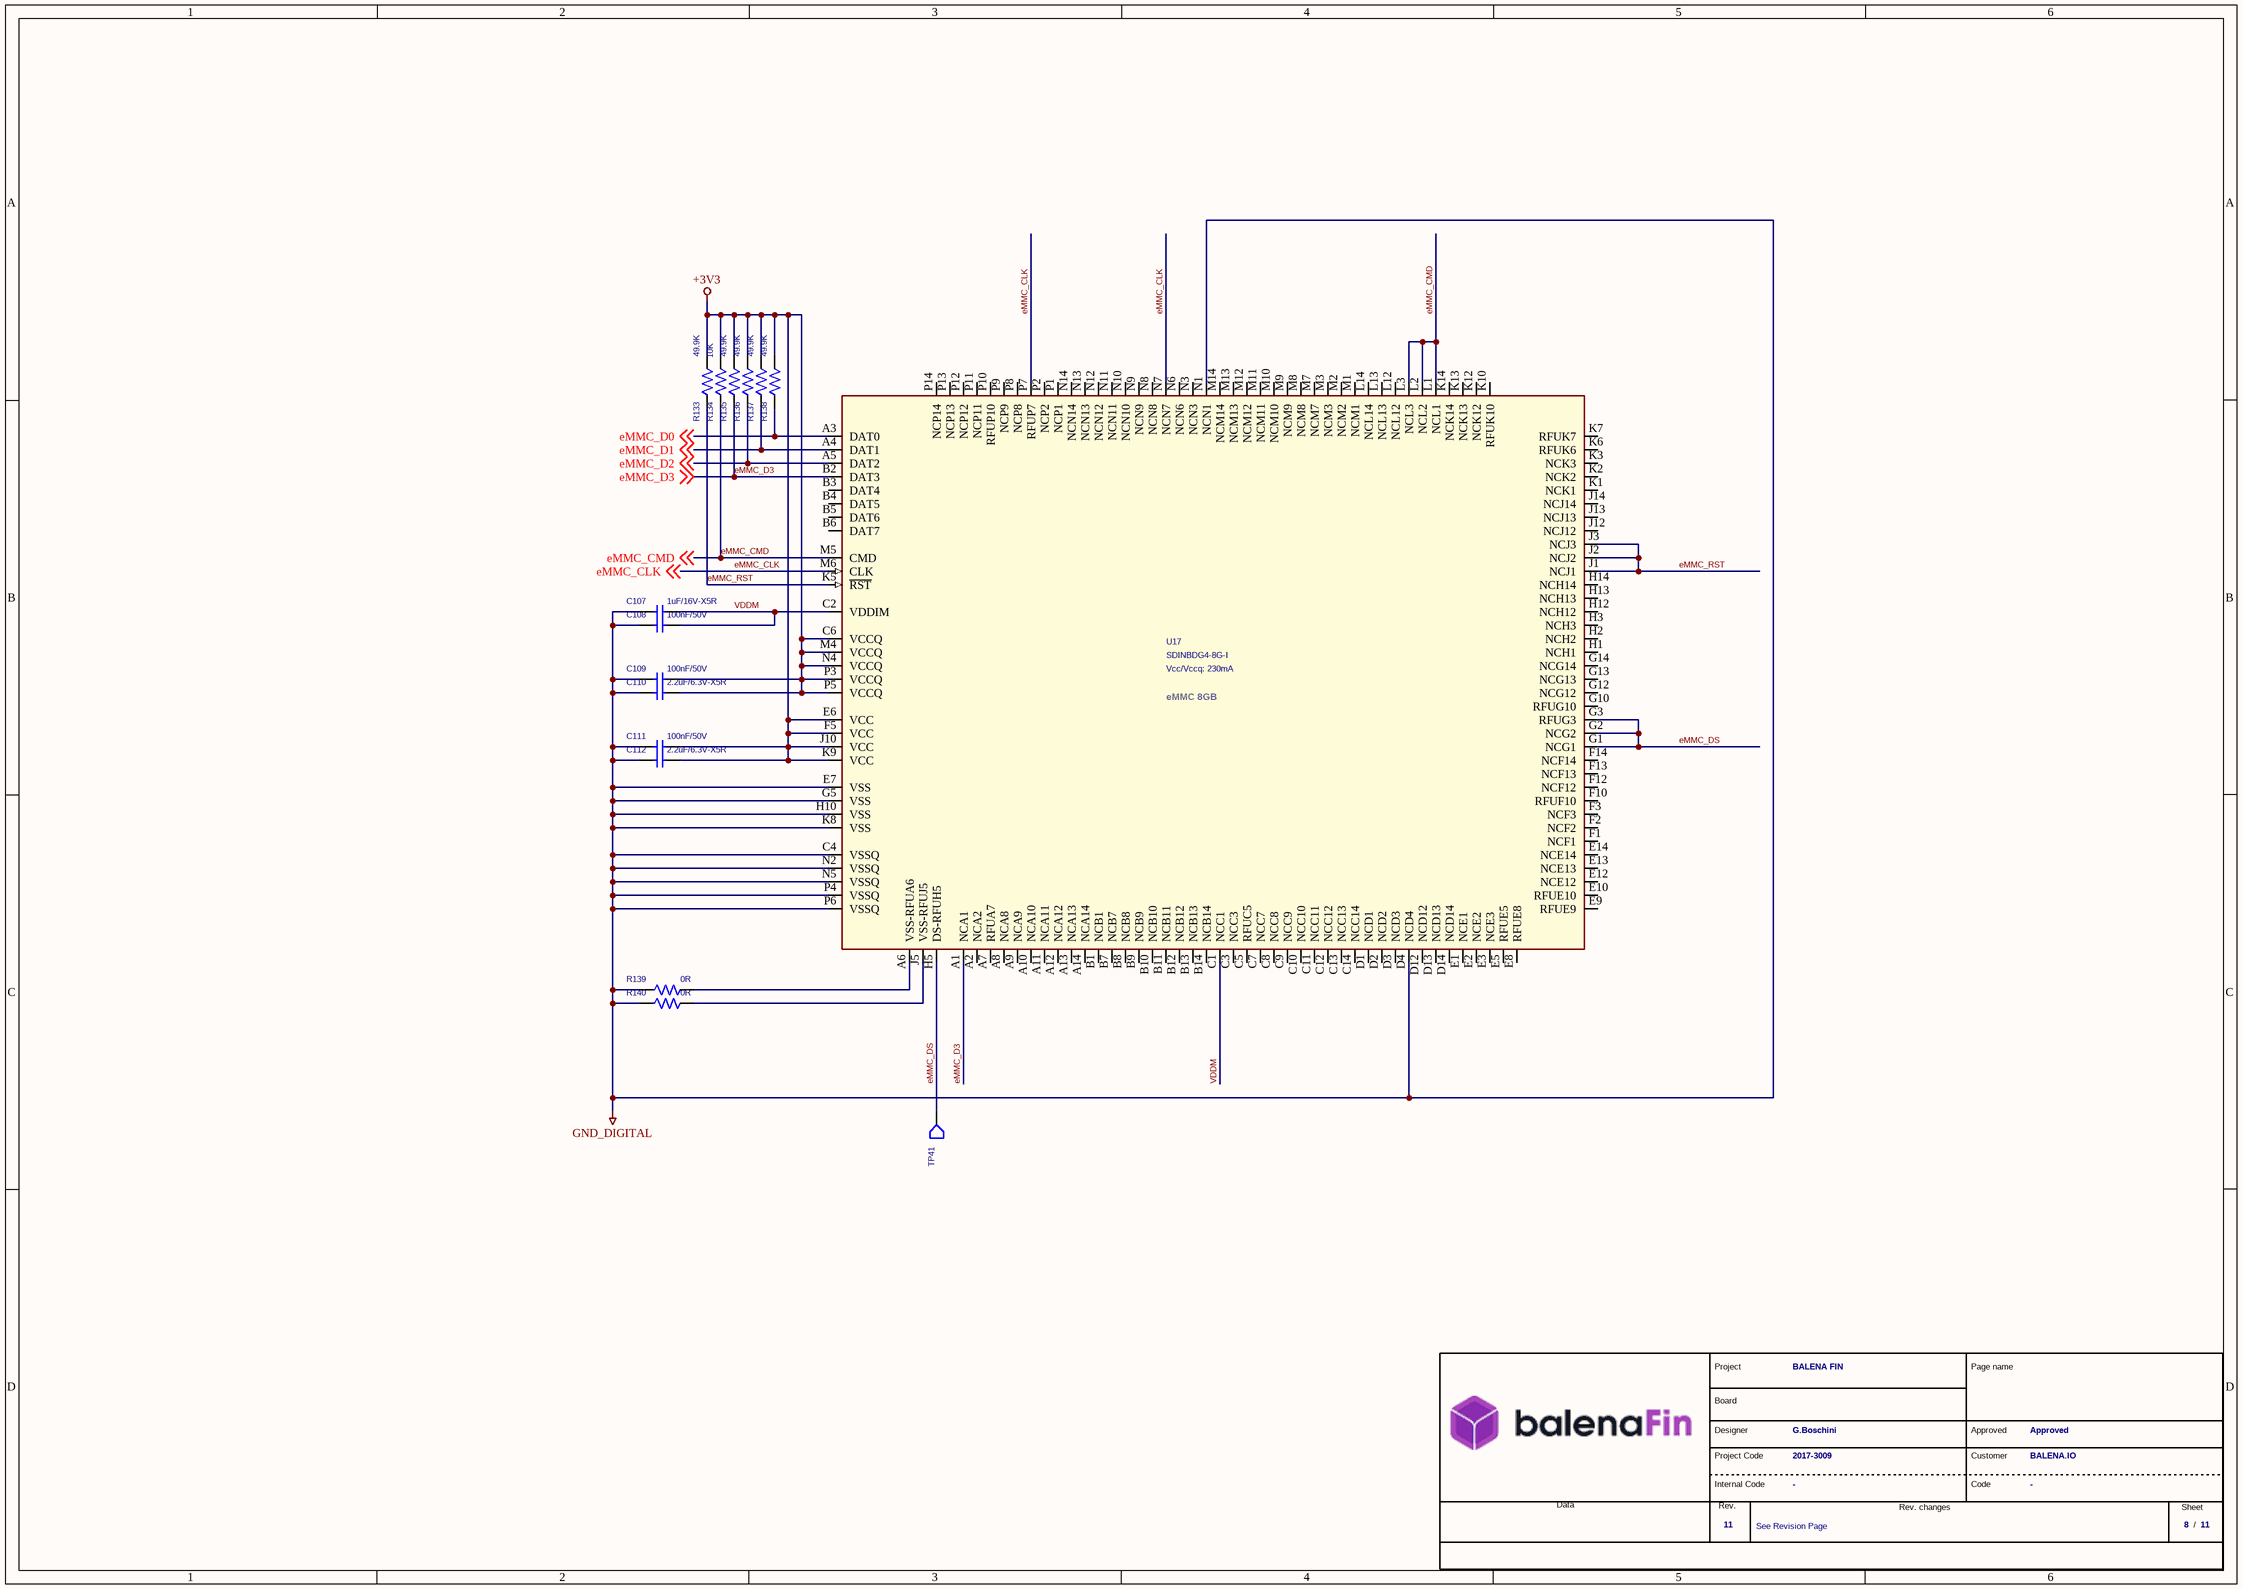
[diagram p9: 07 - eMMC.SchDoc]

### Parts
(Parts that share a designator on the sheet are numbered #1, #2 ... from top to bottom, then left to right.)
*#7  Revision: 11  FAE RD code: 2017-3009  DocumentoRev: See Revision Page  Page Number: 8  Nome Progetto: BALENA FIN  Customer name: BALENA.IO  Project manager: Approved  Project designer: G.Boschini  (hidden comment: MyFAEVuoto)  (graphical)
C107  1uF/16V-X5R  [CS-C-0402]
C108  100nF/50V  [CS-C-0402]
C109  100nF/50V  [CS-C-0402]
C110  2.2uF/6.3V-X5R  [CS-C-0402]
C111  100nF/50V  [CS-C-0402]
C112  2.2uF/6.3V-X5R  [CS-C-0402]
R133  49.9K  [RS-0402]
R134  10K  [RS-0402]
R135  49.9K  [RS-0402]
R136  49.9K  [RS-0402]
R137  49.9K  [RS-0402]
R138  49.9K  [RS-0402]
R139  0R  [RS-0402]
R140  0R  [RS-0402]
TP41  TPS  [TPS-0100]  (value not drawn)  (no BOM)
U17  SDINBDG4-8G-I  Power requirements: Vcc/Vccq: 230mA  [VFBGA153]

### Nets
+3V3: C109.2 C110.2 C111.2 C112.2 R133.2 R134.2 R135.2 R136.2 R137.2 R138.2 U17.C6(VCCQ) U17.E6(VCC) U17.F5(VCC) U17.J10(VCC) U17.K9(VCC) U17.M4(VCCQ) U17.N4(VCCQ) U17.P3(VCCQ) U17.P5(VCCQ)
GND_DIGITAL: C107.1 C108.1 C109.1 C110.1 C111.1 C112.1 R139.1 R140.1 U17.C4(VSSQ) U17.D4(NCD4) U17.E7(VSS) U17.G5(VSS) U17.H10(VSS) U17.K8(VSS) U17.N1(NCN1) U17.N2(VSSQ) U17.N5(VSSQ) U17.P4(VSSQ) U17.P6(VSSQ)
eMMC_CLK: U17.M6(CLK) U17.N7(NCN7) U17.P7(RFUP7) ; off-sheet eMMC_CLK
eMMC_CMD: R134.1 U17.L1(NCL1) U17.L2(NCL2) U17.L3(NCL3) U17.M5(CMD) ; off-sheet eMMC_CMD
eMMC_D0: R138.1 U17.A3(DAT0) ; off-sheet eMMC_D0
eMMC_D1: R137.1 U17.A4(DAT1) ; off-sheet eMMC_D1
eMMC_D2: R136.1 U17.A5(DAT2) ; off-sheet eMMC_D2
eMMC_D3: R135.1 U17.A1(NCA1) U17.B2(DAT3) ; off-sheet eMMC_D3
eMMC_DS: TP41.1(TP) U17.G1(NCG1) U17.G2(NCG2) U17.G3(RFUG3) U17.H5(DS-RFUH5)
eMMC_RST: R133.1 U17.J1(NCJ1) U17.J2(NCJ2) U17.J3(NCJ3) U17.K5(~{RST})
VDDM: C107.2 C108.2 U17.C1(NCC1) U17.C2(VDDIM)
NetR139_2: R139.2 U17.A6(VSS-RFUA6)
NetR140_2: R140.2 U17.J5(VSS-RFUJ5)

Not connected (* = marked no-connect by the designer): U17 A2(NCA2) A7(RFUA7) A8(NCA8) A9(NCA9) A10(NCA10) A11(NCA11) A12(NCA12) A13(NCA13) A14(NCA14) B1(NCB1) B3(DAT4) B4(DAT5) B5(DAT6) B6(DAT7) B7(NCB7) B8(NCB8) B9(NCB9) B10(NCB10) B11(NCB11) B12(NCB12) B13(NCB13) B14(NCB14) C3(NCC3) C5(RFUC5) C7(NCC7) C8(NCC8) C9(NCC9) C10(NCC10) C11(NCC11) C12(NCC12) C13(NCC13) C14(NCC14) D1(NCD1) D2(NCD2) D3(NCD3) D12(NCD12) D13(NCD13) D14(NCD14) E1(NCE1) E2(NCE2) E3(NCE3) E5(RFUE5) E8(RFUE8) E9(RFUE9) E10(RFUE10) E12(NCE12) E13(NCE13) E14(NCE14) F1(NCF1) F2(NCF2) F3(NCF3) F10(RFUF10) F12(NCF12) F13(NCF13) F14(NCF14) G10(RFUG10) G12(NCG12) G13(NCG13) G14(NCG14) H1(NCH1) H2(NCH2) H3(NCH3) H12(NCH12) H13(NCH13) H14(NCH14) J12(NCJ12) J13(NCJ13) J14(NCJ14) K1(NCK1) K2(NCK2) K3(NCK3) K6(RFUK6) K7(RFUK7) K10(RFUK10) K12(NCK12) K13(NCK13) K14(NCK14) L12(NCL12) L13(NCL13) L14(NCL14) M1(NCM1) M2(NCM2) M3(NCM3) M7(NCM7) M8(NCM8) M9(NCM9) M10(NCM10) M11(NCM11) M12(NCM12) M13(NCM13) M14(NCM14) N3(NCN3) N6(NCN6) N8(NCN8) N9(NCN9) N10(NCN10) N11(NCN11) N12(NCN12) N13(NCN13) N14(NCN14) P1(NCP1) P2(NCP2) P8(NCP8) P9(NCP9) P10(RFUP10) P11(NCP11) P12(NCP12) P13(NCP13) P14(NCP14)

### Notes on the sheet
- (in symbol eMMC - SDINBDG4-8G-I - 8GB) eMMC 8GB
- (in symbol MyFAEVuoto) Project; Page name; Board; Designer; Project Code; Customer; Internal Code; Code; Data; Rev.; Rev. changes; Sheet; /

### Library data of the parts
C107 = CS-C-0402-1u/16-X5R: CHIP CAP.CER. 1uF 16V 10% X5R 0402; MPN: Generic; Pkg Type: SMD; Room: eMMC; Mount: Yes
C108 C109 C111 = CS-C-0402-100n/16V: CHIP CAP.CER. 100nF 16V 10% X7R 0402; MPN: Generic; Alternative MPN: C0402C104K4RACTU; Room: eMMC; Pkg Type: SMD; Mount: Yes
C110 C112 = CS-C-0402-2.2u/6V3-X5R: CHIP CAP.CER. 2.2uF 6.3V 20% X5R 0402; MPN: Generic; Room: eMMC; Pkg Type: SMD; Mount: Yes
R133 R135-R138 = RS-0402-49.9k: CHIP RES. 49K9 0402 1/16W 1% 100PPM/°C; MPN: Generic; Room: eMMC; Note: 100 ppm; Pkg Type: SMD; Temperature range: -55°..+155°; Mount: Yes
R134 = RS-0402-10k: CHIP RES. 10K 0402 1/16W 1%; MPN: Generic; Room: eMMC; Pkg Type: SMD; Temperature range: -55°..+125°; Mount: Yes
R139 R140 = RS-0402-0r: CHIP RES. 0R 0402 1/16W 1%; MPN: Generic; Room: eMMC; Pkg Type: SMD; Mount: Yes
TP41 = TEST POINT SMD 1 MM: TEST POINT SMD; MPN: TP-No-BoM; Room: eMMC; Pkg Type: SMD; Mount: Yes
U17 = eMMC - SDINBDG4-8G-I - 8GB: IC eMMC SDINBDG4-8G SANDISK VFBGA153 SMT; Note: Standard 5.1 - VCC=2.7V-3.6V - VCCQ=1.7V-1.95V/2.7V-3.6V; Pkg Type: SMD; Room: eMMC; Temperature range: -25°..+85°; MPN: SDINBDG4-8G-I; Mount: Yes
*#7 = MyFAEVuoto: Page Count: 11; Customer Code: -; Database: -

## Sheet 08 - HAT.SchDoc
size 420 x 297 mm
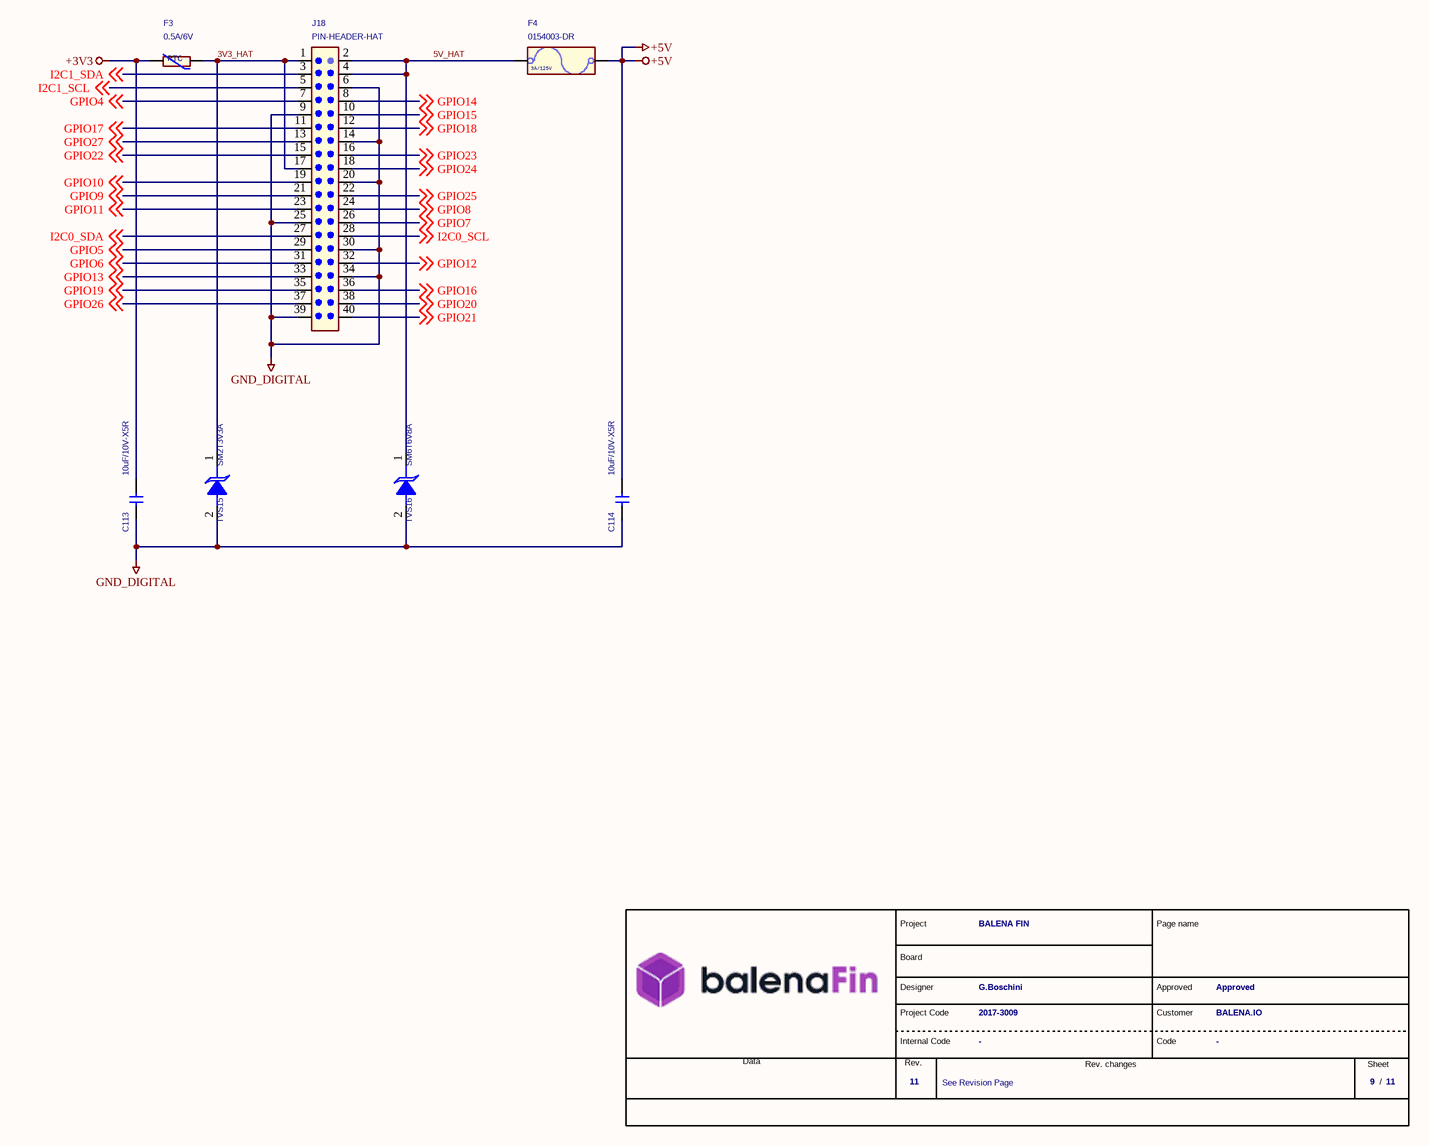
[diagram p10: 08 - HAT.SchDoc]

### Parts
(Parts that share a designator on the sheet are numbered #1, #2 ... from top to bottom, then left to right.)
*#8  Revision: 11  FAE RD code: 2017-3009  DocumentoRev: See Revision Page  Page Number: 9  Nome Progetto: BALENA FIN  Customer name: BALENA.IO  Project manager: Approved  Project designer: G.Boschini  (hidden comment: MyFAEVuoto)  (graphical)
C113  10uF/10V-X5R  [CS-C-0603]
C114  10uF/10V-X5R  [CS-C-0603]
F3  0.5A/6V  [FS-0603]
F4  0154003-DR  [F-LT154]
J18  PIN-HEADER-HAT  [J-20X2-0254-MDT]
TVS15  SM2T3V3A  [D-DO216AA]
TVS16  SM6T6V8A  [SMB]

### Nets
+3V3: C113.1 F3.1
+5V: C114.1 F4.2
GND_DIGITAL: C113.2 C114.2 J18.6 J18.9 J18.14 J18.20 J18.25 J18.30 J18.34 J18.39 TVS15.2(A) TVS16.2(A)
3V3_HAT: F3.2 J18.1 J18.17 TVS15.1(C)
5V_HAT: F4.1 J18.2 J18.4 TVS16.1(C)
GPIO4: J18.7 ; off-sheet GPIO4
GPIO5: J18.29 ; off-sheet GPIO5
GPIO6: J18.31 ; off-sheet GPIO6
GPIO7: J18.26 ; off-sheet GPIO7
GPIO8: J18.24 ; off-sheet GPIO8
GPIO9: J18.21 ; off-sheet GPIO9
GPIO10: J18.19 ; off-sheet GPIO10
GPIO11: J18.23 ; off-sheet GPIO11
GPIO12: J18.32 ; off-sheet GPIO12
GPIO13: J18.33 ; off-sheet GPIO13
GPIO14: J18.8 ; off-sheet GPIO14
GPIO15: J18.10 ; off-sheet GPIO15
GPIO16: J18.36 ; off-sheet GPIO16
GPIO17: J18.11 ; off-sheet GPIO17
GPIO18: J18.12 ; off-sheet GPIO18
GPIO19: J18.35 ; off-sheet GPIO19
GPIO20: J18.38 ; off-sheet GPIO20
GPIO21: J18.40 ; off-sheet GPIO21
GPIO22: J18.15 ; off-sheet GPIO22
GPIO23: J18.16 ; off-sheet GPIO23
GPIO24: J18.18 ; off-sheet GPIO24
GPIO25: J18.22 ; off-sheet GPIO25
GPIO26: J18.37 ; off-sheet GPIO26
GPIO27: J18.13 ; off-sheet GPIO27
I2C0_SCL: J18.28 ; off-sheet I2C0_SCL
I2C0_SDA: J18.27 ; off-sheet I2C0_SDA
I2C1_SCL: J18.5 ; off-sheet I2C1_SCL
I2C1_SDA: J18.3 ; off-sheet I2C1_SDA

### Notes on the sheet
- (in symbol MyFAEVuoto) Project; Page name; Board; Designer; Project Code; Customer; Internal Code; Code; Data; Rev.; Rev. changes; Sheet; /
- (in symbol PTC - MF-FSMF050X-2 -0.5A/6V) PTC
- (in symbol RAPIDO - 0154003.DR - 3A/125V) 3A/125V

### Library data of the parts
C113 C114 = CS-C-0603-10u/10V-X5R: CHIP CAP.CER. 10uF 10V 10% X5R 0603; MPN: Generic; Pkg Type: SMD; Room: CONNETTORE HAT; Mount: Yes
F3 = PTC - MF-FSMF050X-2 -0.5A/6V: PTC RESET FUSE 6V 500MA 0603; Pkg Type: SMD; Note: Ihold=500mA - Itrip=1A - Imax=40A; MPN: MF-FSMF050X-2; Mount: Yes
F4 = RAPIDO - 0154003.DR - 3A/125V: FUSE BOARD MNT 3A 125VAC/VDC SMD; Room: POWER IN; Pkg Type: SMD; MPN: 0154003-DR; Mount: Yes
J18 = STRIP-J-20X2-0254-MDT: CONN HEADER THT 40POS 2.54MM DUAL ROW RPi Color coded; MPN: PZX20180117132; Room: CONNETTORE HAT; Note: H=8.5mm; Pkg Type: THT; Mount: Yes
TVS15 = TVS-UNI - SM2T3V3A - 3.6V/200W: TVS DIODE 3.3VWM 6.8VC DO216AA; Note: Unidirectional; Pkg Type: SMD; Room: CONNETTORE HAT; MPN: SM2T3V3A; Mount: Yes
TVS16 = TVS-UNI - SM6T6V8A - 6.8V/600W: TVS DIODE 5.8VWM 13.4VC SMB; Pkg Type: SMD; Note: Unidirectional; Room: CONNETTORE HAT; MPN: SM6T6V8A; Mount: Yes
*#8 = MyFAEVuoto: Page Count: 11; Customer Code: -; Database: -

## Sheet 09 - mPCIE.SchDoc
size 420 x 297 mm
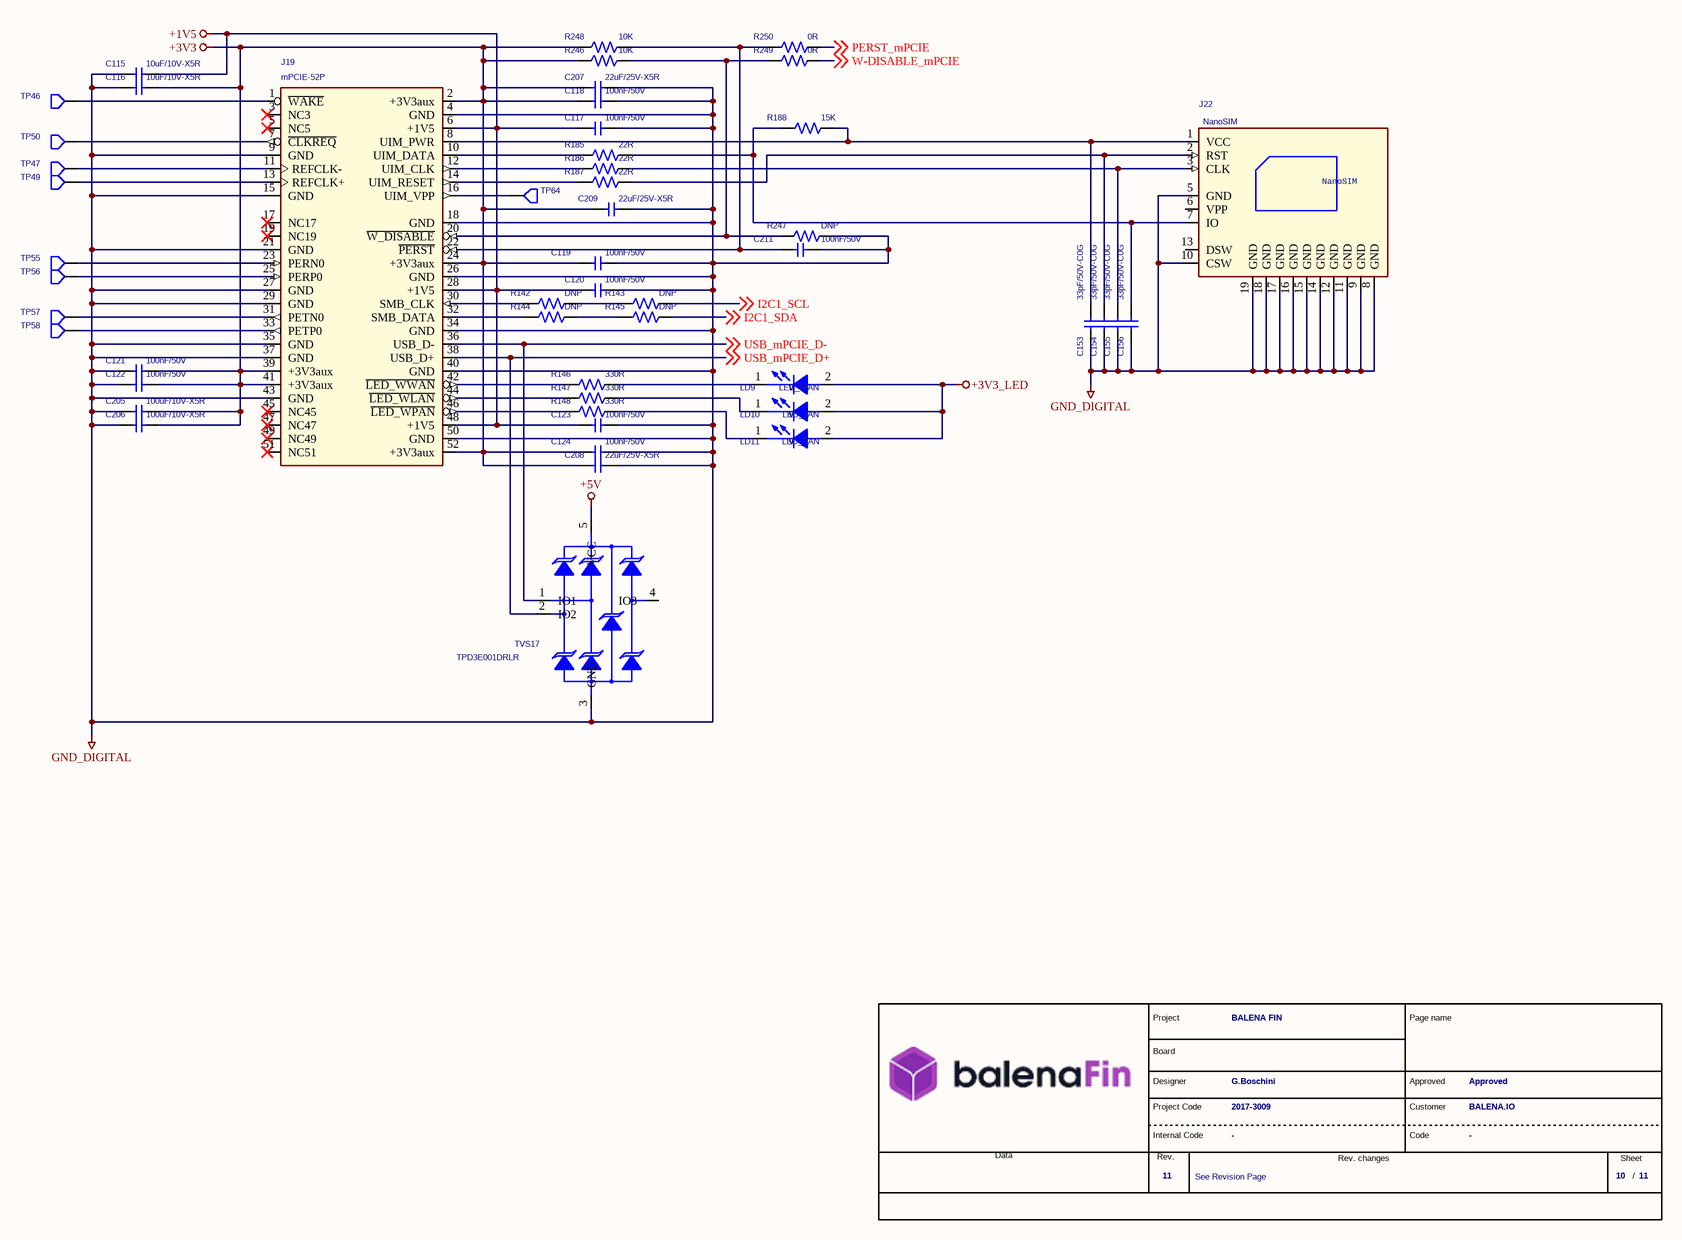
[diagram p11: 09 - mPCIE.SchDoc]

### Parts
(Parts that share a designator on the sheet are numbered #1, #2 ... from top to bottom, then left to right.)
*#9  Revision: 11  FAE RD code: 2017-3009  DocumentoRev: See Revision Page  Page Number: 10  Nome Progetto: BALENA FIN  Customer name: BALENA.IO  Project manager: Approved  Project designer: G.Boschini  (hidden comment: MyFAEVuoto)  (graphical)
C115  10uF/10V-X5R  [CS-C-0603]
C116  10uF/10V-X5R  [CS-C-0603]
C117  100nF/50V  [CS-C-0402]
C118  100nF/50V  [CS-C-0402]
C119  100nF/50V  [CS-C-0402]
C120  100nF/50V  [CS-C-0402]
C121  100nF/50V  [CS-C-0402]
C122  100nF/50V  [CS-C-0402]
C123  100nF/50V  [CS-C-0402]
C124  100nF/50V  [CS-C-0402]
C153  33pF/50V-C0G  [CS-C-0402]
C154  33pF/50V-C0G  [CS-C-0402]
C155  33pF/50V-C0G  [CS-C-0402]
C156  33pF/50V-C0G  [CS-C-0402]
C205  100uF/10V-X5R  [CS-C-1210]
C206  100uF/10V-X5R  [CS-C-1210]
C207  22uF/25V-X5R  [CS-C-1206]
C208  22uF/25V-X5R  [CS-C-1206]
C209  22uF/25V-X5R  [CS-C-1206]
C211  100nF/50V  [CS-C-0402]
J19  mPCIE-52P  [J-26X2-0080-FOS-2041119]
J22  NanoSIM  [J-NANOSIM-SF72S006VBA]
LD9  LED_WAN  [LD-0603]
LD10  LED_LAN  [LD-0603]
LD11  LED_PAN  [LD-0603]
R142  DNP  [RS-0402]
R143  DNP  [RS-0402]
R144  DNP  [RS-0402]
R145  DNP  [RS-0402]
R146  330R  [RS-0402]
R147  330R  [RS-0402]
R148  330R  [RS-0402]
R185  22R  [RS-0603]
R186  22R  [RS-0603]
R187  22R  [RS-0603]
R188  15K  [RS-0402]
R246  10K  [RS-0402]
R247  DNP  [RS-0402]
R248  10K  [RS-0402]
R249  0R  [RS-0402]
R250  0R  [RS-0402]
TP46  TPS  [TPS-0100]  (value not drawn)  (no BOM)
TP47  TPS  [TPS-0100]  (value not drawn)  (no BOM)
TP49  TPS  [TPS-0100]  (value not drawn)  (no BOM)
TP50  TPS  [TPS-0100]  (value not drawn)  (no BOM)
TP55  TPS  [TPS-0100]  (value not drawn)  (no BOM)
TP56  TPS  [TPS-0100]  (value not drawn)  (no BOM)
TP57  TPS  [TPS-0100]  (value not drawn)  (no BOM)
TP58  TPS  [TPS-0100]  (value not drawn)  (no BOM)
TP64  TPS  [TPS-0100]  (value not drawn)  (no BOM)
TVS17  TPD3E001DRLR  [SOP5_USON6]

### Nets
+1V5: C115.2 C117.1 C120.1 C123.1 J19.6(+1V5) J19.28(+1V5) J19.48(+1V5)
+3V3: C116.2 C118.1 C119.1 C121.2 C122.2 C124.1 C205.2 C206.2 C207.1 C208.1 C209.1 J19.2(+3V3aux) J19.24(+3V3aux) J19.39(+3V3aux) J19.41(+3V3aux) J19.52(+3V3aux) R246.2 R248.2
+3V3_LED: LD9.2(A) LD10.2(A) LD11.2(A)
+5V: TVS17.5(VCC)
GND_DIGITAL: C115.1 C116.1 C117.2 C118.2 C119.2 C120.2 C121.1 C122.1 C123.2 C124.2 C153.2 C154.2 C155.2 C156.2 C205.1 C206.1 C207.2 C208.2 C209.2 C211.2 J19.4(GND) J19.9(GND) J19.15(GND) J19.18(GND) J19.21(GND) J19.26(GND) J19.27(GND) J19.29(GND) J19.34(GND) J19.35(GND) J19.37(GND) J19.40(GND) J19.43(GND) J19.50(GND) J22.5(GND) J22.8(GND) J22.9(GND) J22.10(CSW) J22.11(GND) J22.12(GND) J22.14(GND) J22.15(GND) J22.16(GND) J22.17(GND) J22.18(GND) J22.19(GND) R247.1 TVS17.3(GND)
I2C1_SCL: R143.2 ; off-sheet I2C1_SCL
I2C1_SDA: R145.2 ; off-sheet I2C1_SDA
PERST_mPCIE: R250.2 ; off-sheet PERST_mPCIE
USB_mPCIE_D+: J19.38(USB_D+) TVS17.2(IO2) ; off-sheet USB_mPCIE_D+
USB_mPCIE_D-: J19.36(USB_D-) TVS17.1(IO1) ; off-sheet USB_mPCIE_D-
W-DISABLE_mPCIE: R249.2 ; off-sheet W-DISABLE_mPCIE
NetC153_1: C153.1 J19.8(UIM_PWR) J22.1(VCC) R188.2
NetC154_1: C154.1 J22.2(RST) R187.2
NetC155_1: C155.1 J22.3(CLK) R186.2
NetC156_1: C156.1 J22.7(IO) R185.2 R188.1
NetC211_1: C211.1 J19.22(~{PERST}) R248.1 R250.1
NetJ19_1: J19.1(~{WAKE}) TP46.1(TP)
NetJ19_7: J19.7(~{CLKREQ}) TP50.1(TP)
NetJ19_10: J19.10(UIM_DATA) R185.1
NetJ19_11: J19.11(REFCLK-) TP47.1(TP)
NetJ19_12: J19.12(UIM_CLK) R186.1
NetJ19_13: J19.13(REFCLK+) TP49.1(TP)
NetJ19_14: J19.14(UIM_RESET) R187.1
NetJ19_16: J19.16(UIM_VPP) TP64.1(TP)
NetJ19_20: J19.20(~{W_DISABLE}) R246.1 R247.2 R249.1
NetJ19_23: J19.23(PERN0) TP55.1(TP)
NetJ19_25: J19.25(PERP0) TP56.1(TP)
NetJ19_30: J19.30(SMB_CLK) R142.1
NetJ19_31: J19.31(PETN0) TP57.1(TP)
NetJ19_32: J19.32(SMB_DATA) R144.1
NetJ19_33: J19.33(PETP0) TP58.1(TP)
NetJ19_42: J19.42(~{LED_WWAN}) R146.1
NetJ19_44: J19.44(~{LED_WLAN}) R147.1
NetJ19_46: J19.46(~{LED_WPAN}) R148.1
NetLD9_1: LD9.1(C) R146.2
NetLD10_1: LD10.1(C) R147.2
NetLD11_1: LD11.1(C) R148.2
NetR142_2: R142.2 R143.1
NetR144_2: R144.2 R145.1

Not connected (* = marked no-connect by the designer): J19 3(NC3)* 5(NC5)* 17(NC17)* 19(NC19)* 45(NC45)* 47(NC47)* 49(NC49)* 51(NC51)*; J22 6(VPP) 13(DSW); TVS17 4(IO3)

### Notes on the sheet
- (in symbol LED V - GENERICO - 0603) V
- (in symbol MyFAEVuoto) Project; Page name; Board; Designer; Project Code; Customer; Internal Code; Code; Data; Rev.; Rev. changes; Sheet; /

### Library data of the parts
C115 C116 = CS-C-0603-10u/10V-X5R: CHIP CAP.CER. 10uF 10V 10% X5R 0603; MPN: Generic; Pkg Type: SMD; Room: mPCIE; Mount: Yes
C117-C124 C211 = CS-C-0402-100n/16V: CHIP CAP.CER. 100nF 16V 10% X7R 0402; MPN: Generic; Alternative MPN: C0402C104K4RACTU; Room: mPCIE; Pkg Type: SMD; Mount: Yes
C153-C156 = CS-C-0402-33p/50V-C0G: CHIP CAP.CER. 33pF 50V 5% C0G 0402; MPN: Generic; Room: NANO-SIM; Pkg Type: SMD; Mount: Yes
C205 C206 = CS-C-1210-100u/10V-X5R: CHIP CAP.CER. 100UF 10V 20% X5R 1210; MPN: Generic; Pkg Type: SMD; Room: mPCIE; Mount: Yes
C207-C209 = CS-C-1206-22u/25V-X5R: CHIP CAP.CER. 22uF 25V 10% X5R 1206; MPN: Generic; Room: mPCIE; Pkg Type: SMD; Temperature range: -55°..+85°; Mount: Yes
J19 = mPCIE - J-26X2-0080-FOS-2041119: CONN PCI EXP MINI FEMALE 52POS; MPN: 2041119-1; Pkg Type: SMD; Note: 0.5A/50VAC; Room: mPCIE; Temperature range: -55°..+85°; Mount: Yes
J22 = NANOSIM - J-NANOSIM-SF72S006VBA: CONN NANO SIM CARD PUSH-PUSH; MPN: SF72S006VBAR2500; Alternative MPN: SF72S006VBDR2500; Pkg Type: SMD; Room: NANO-SIM; Temperature range: -25°..+85°; Mount: Yes
LD9-LD11 = LED V - GENERICO - 0603: LED Green 0603 SMT; Alternative MPN: KP-1608SGC; Pkg Type: SMD; Note: V=2.2V/20mA; MPN: Generic; Mount: Yes
R142-R145 = RS-0402: as R297 on sheet 06 - MCU
R146-R148 = RS-0402-330r: CHIP RES. 330R 0402 1/16W 1%; MPN: Generic; Pkg Type: SMD; Room: mPCIE; Mount: Yes
R185-R187 = RS-0603-22r: CHIP RES. 22R 0603 1/16W 1%; MPN: Generic; Pkg Type: SMD; Room: NANO-SIM; Mount: Yes
R188 = RS-0402-15k: CHIP RES. 15K 0402 1/16W 1%; MPN: Generic; Pkg Type: SMD; Room: NANO-SIM; Temperature range: -55°..+155°; Mount: Yes
R246 R248 = RS-0402-10k: CHIP RES. 10K 0402 1/16W 1%; MPN: Generic; Room: mPCIE; Pkg Type: SMD; Temperature range: -55°..+125°; Mount: Yes
R247 = RS-0402: CHIP RES. 0402; MPN: Generic; Pkg Type: SMD; Room: mPCIE; Mount: No
R249 R250 = RS-0402-0r: CHIP RES. 0R 0402 1/16W 1%; MPN: Generic; Room: mPCIE; Pkg Type: SMD; Mount: Yes
TP46 TP47 TP49 TP50 TP55-TP58 TP64 = TEST POINT SMD 1 MM: TEST POINT SMD; MPN: TP-No-BoM; Room: mPCIE; Pkg Type: SMD; Mount: Yes
TVS17 = TVS-UNI3x - TPD3E001DRLR - USB: TVS DIODE 5.5VWM; Note: Unidirectional - High-Speed Data Interface - USB; Pkg Type: SMD; Room: mPCIE; Temperature range: -40°..+85°; MPN: TPD3E001DRLR; Mount: Yes
*#9 = MyFAEVuoto: Page Count: 11; Customer Code: -; Database: -

## Sheet 10 - ETHERNET.SchDoc
size 420 x 297 mm
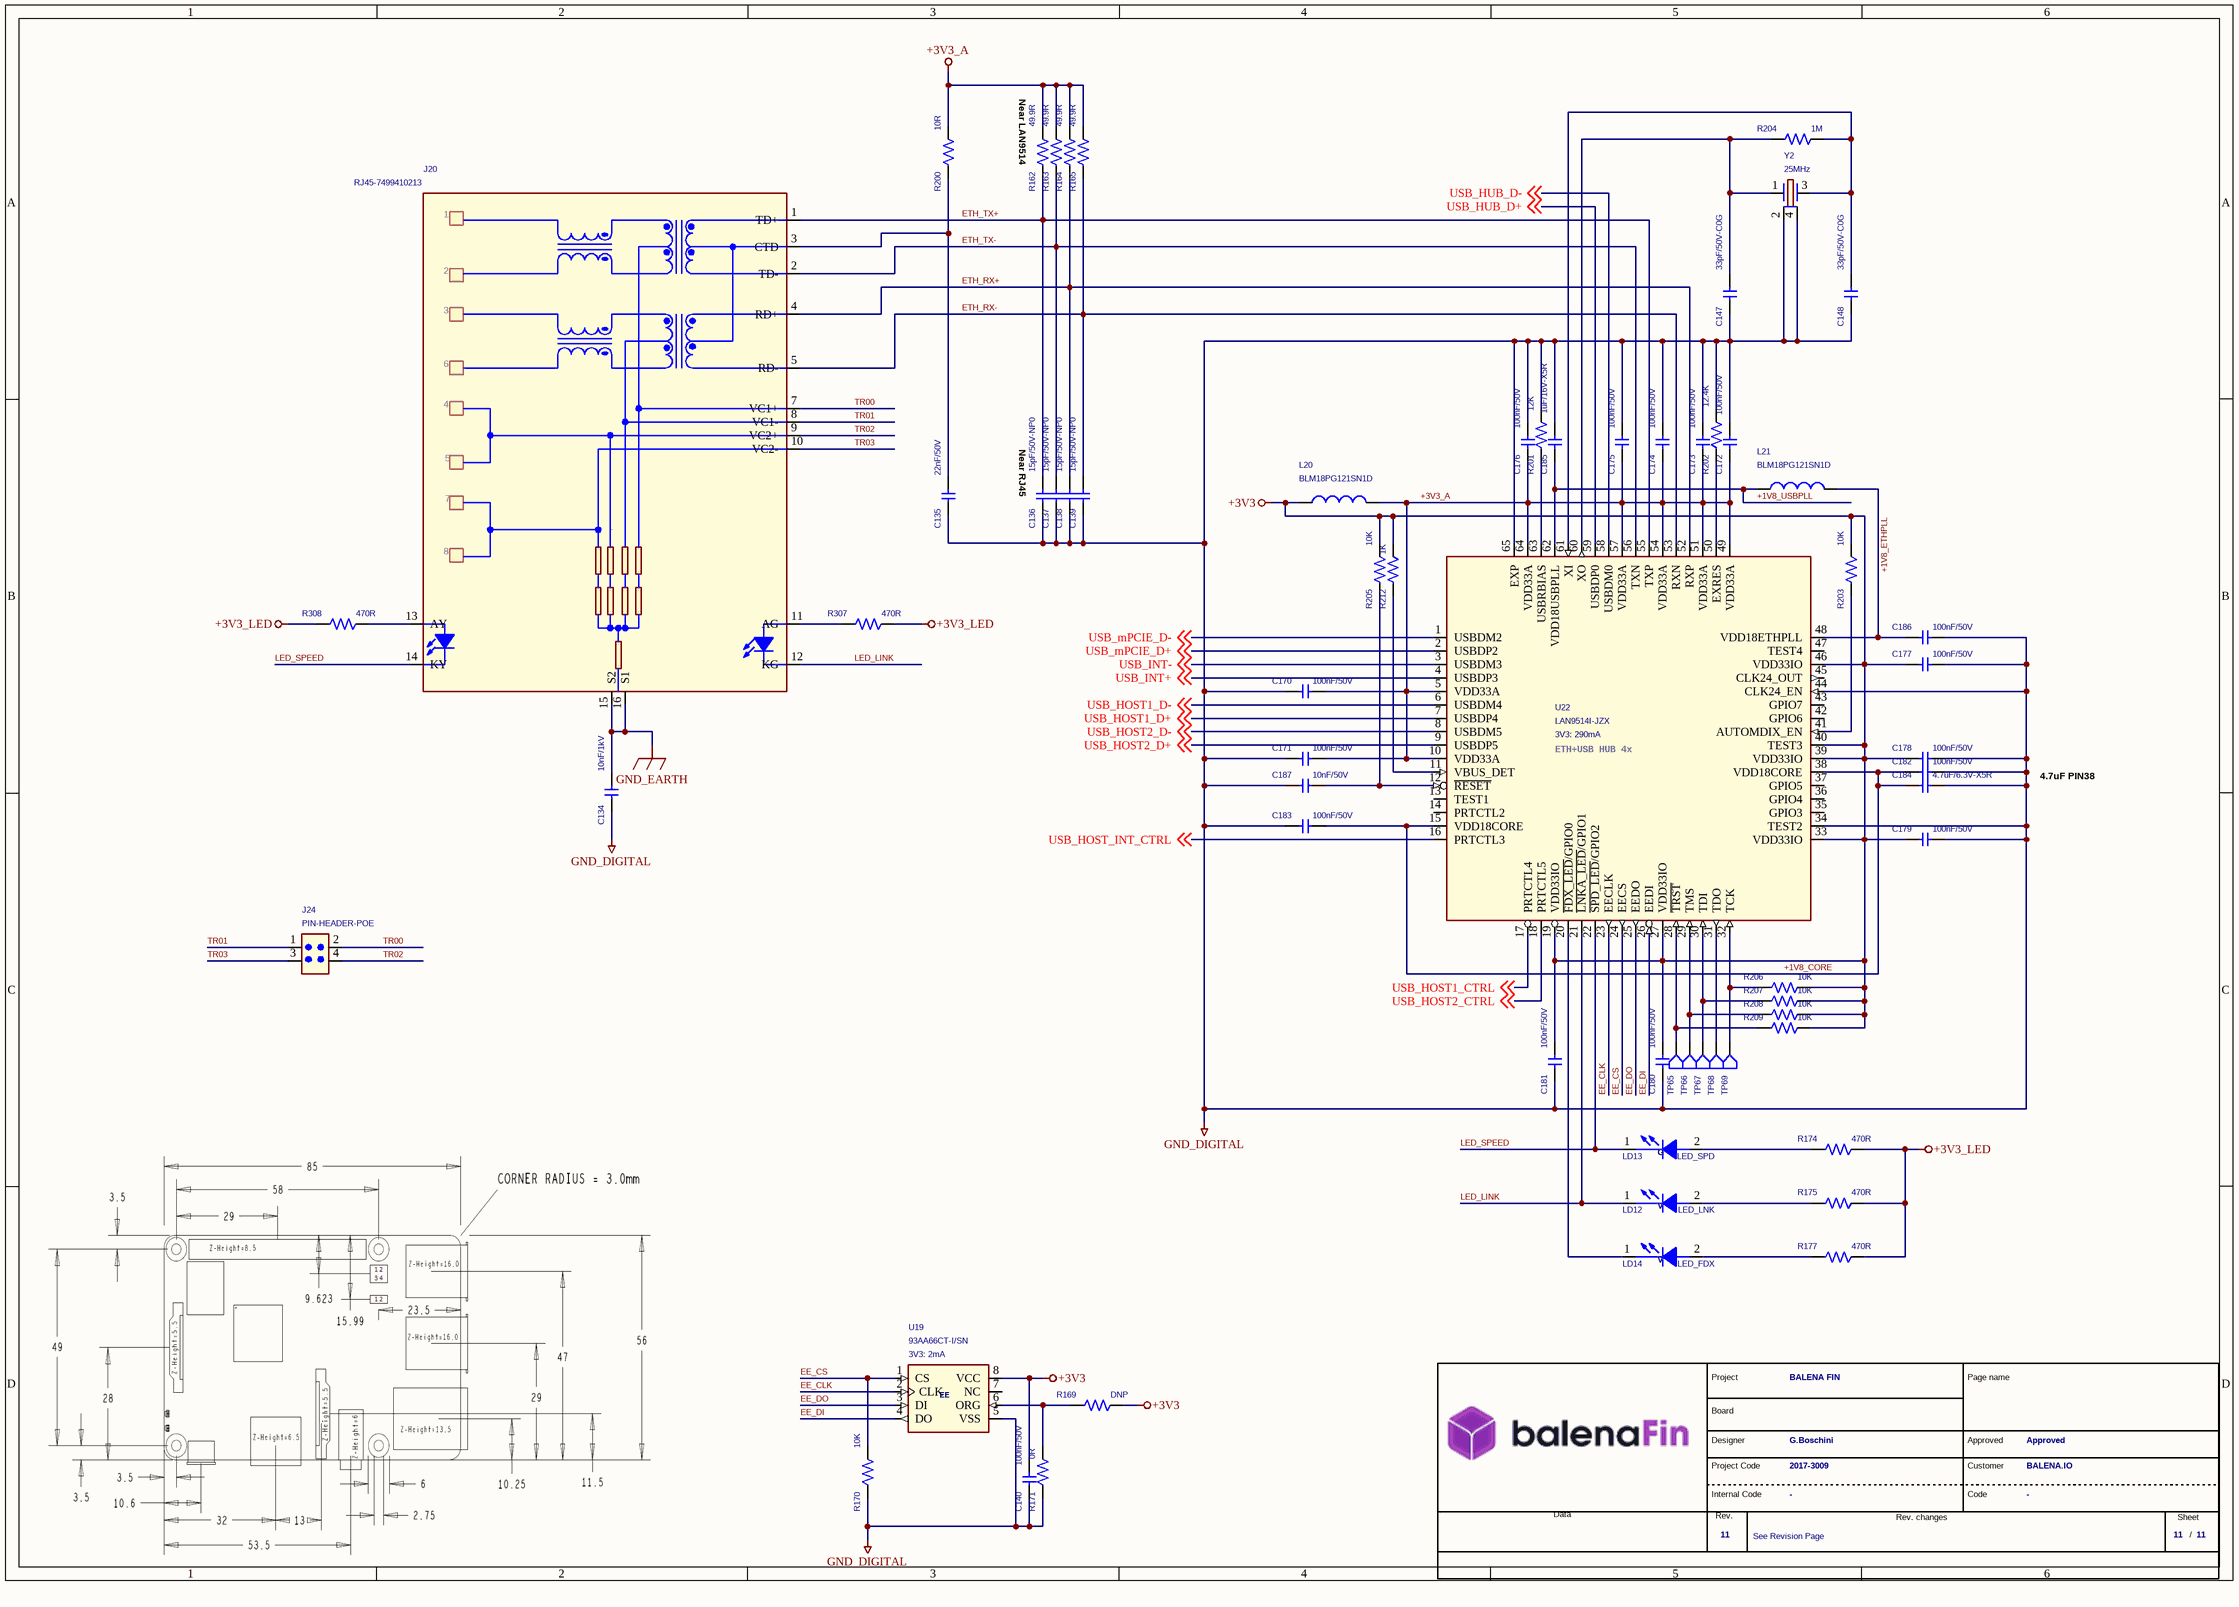
[diagram p12: 10 - ETHERNET.SchDoc]

### Parts
(Parts that share a designator on the sheet are numbered #1, #2 ... from top to bottom, then left to right.)
*#10  Revision: 11  FAE RD code: 2017-3009  DocumentoRev: See Revision Page  Nome Progetto: BALENA FIN  Customer name: BALENA.IO  Project manager: Approved  Project designer: G.Boschini  (hidden comment: MyFAEVuoto)  (graphical)
C134  10nF/1kV  [CS-C-1206]
C135  22nF/50V  [CS-C-0603]
C136  15pF/50V-NP0  [CS-C-0402]
C137  15pF/50V-NP0  [CS-C-0402]
C138  15pF/50V-NP0  [CS-C-0402]
C139  15pF/50V-NP0  [CS-C-0402]
C140  100nF/50V  [CS-C-0402]
C147  33pF/50V-C0G  [CS-C-0402]
C148  33pF/50V-C0G  [CS-C-0402]
C170  100nF/50V  [CS-C-0402]
C171  100nF/50V  [CS-C-0402]
C172  100nF/50V  [CS-C-0402]
C173  100nF/50V  [CS-C-0402]
C174  100nF/50V  [CS-C-0402]
C175  100nF/50V  [CS-C-0402]
C176  100nF/50V  [CS-C-0402]
C177  100nF/50V  [CS-C-0402]
C178  100nF/50V  [CS-C-0402]
C179  100nF/50V  [CS-C-0402]
C180  100nF/50V  [CS-C-0402]
C181  100nF/50V  [CS-C-0402]
C182  100nF/50V  [CS-C-0402]
C183  100nF/50V  [CS-C-0402]
C184  4.7uF/6.3V-X5R  [CS-C-0402]
C185  1uF/16V-X5R  [CS-C-0402]
C186  100nF/50V  [CS-C-0402]
C187  10nF/50V  [CS-C-0402]
J20  RJ45-7499410213  [J-RJ45-7499410213]
J24  PIN-HEADER-POE  [J-2X2-0254-MDT-TSM]
L20  BLM18PG121SN1D  [LS-0603]
L21  BLM18PG121SN1D  [LS-0603]
LD12  LED_LNK  [LD-0603]
LD13  LED_SPD  [LD-0603]
LD14  LED_FDX  [LD-0603]
R162  49.9R  [RS-0402]
R163  49.9R  [RS-0402]
R164  49.9R  [RS-0402]
R165  49.9R  [RS-0402]
R169  DNP  [RS-0402]
R170  10K  [RS-0402]
R171  0R  [RS-0402]
R174  470R  [RS-0402]
R175  470R  [RS-0402]
R177  470R  [RS-0402]
R200  10R  [RS-0402]
R201  12K  [RS-0402]
R202  12.4K  [RS-0402]
R203  10K  [RS-0402]
R204  1M  [RS-0402]
R205  10K  [RS-0402]
R206  10K  [RS-0402]
R207  10K  [RS-0402]
R208  10K  [RS-0402]
R209  10K  [RS-0402]
R212  1K  [RS-0402]
R307  470R  [RS-0402]
R308  470R  [RS-0402]
TP65  TPS  [TPS-0100]  (value not drawn)  (no BOM)
TP66  TPS  [TPS-0100]  (value not drawn)  (no BOM)
TP67  TPS  [TPS-0100]  (value not drawn)  (no BOM)
TP68  TPS  [TPS-0100]  (value not drawn)  (no BOM)
TP69  TPS  [TPS-0100]  (value not drawn)  (no BOM)
U19  93AA66CT-I/SN  Power requirements: 3V3: 2mA  [SOIC8]
U22  LAN9514I-JZX  Power requirements: 3V3: 290mA  [IC-LAN9514]
Y2  25MHz  [Y-ABM8G]

### Nets
+3V3: C140.1 C177.1 C178.1 C179.1 C180.1 C181.1 L20.1 R169.2 R203.2 R205.2 R206.2 R207.2 R208.2 R209.2 R212.2 U19.8(VCC) U22.19(VDD33IO) U22.27(VDD33IO) U22.33(VDD33IO) U22.39(VDD33IO) U22.40(TEST3) U22.46(VDD33IO)
+3V3_A: C170.2 C171.2 C172.2 C173.2 C174.2 C175.2 C176.2 L20.2 R162.2 R163.2 R164.2 R165.2 R200.2 U22.5(VDD33A) U22.10(VDD33A) U22.49(VDD33A) U22.51(VDD33A) U22.54(VDD33A) U22.57(VDD33A) U22.64(VDD33A)
+3V3_LED: R174.2 R175.2 R177.2 R307.2 R308.1
GND_DIGITAL: C134.1 C135.2 C136.2 C137.2 C138.2 C139.2 C140.2 C147.2 C148.2 C170.1 C171.1 C172.1 C173.1 C174.1 C175.1 C176.1 C177.2 C178.2 C179.2 C180.2 C181.2 C182.2 C183.1 C184.2 C185.1 C186.2 C187.1 R170.1 R171.1 R201.2 R202.2 U19.5(VSS) U22.34(TEST2) U22.44(CLK24_EN) U22.65(EXP) Y2.2 Y2.4
GND_EARTH: C134.2 J20.15(S2) J20.16(S1)
+1V8_CORE: C182.1 C183.2 C184.1 U22.15(VDD18CORE) U22.38(VDD18CORE)
+1V8_ETHPLL: C186.1 L21.2 U22.48(VDD18ETHPLL)
+1V8_USBPLL: C185.2 L21.1 U22.62(VDD18USBPLL)
EE_CLK: U19.2(CLK) U22.23(EECLK)
EE_CS: R170.2 U19.1(CS) U22.24(EECS)
EE_DI: U19.4(DO) U22.26(EEDI)
EE_DO: U19.3(DI) U22.25(EEDO)
ETH_RX+: C138.1 J20.4(RD+) R164.1 U22.52(RXP)
ETH_RX-: C139.1 J20.5(RD-) R165.1 U22.53(RXN)
ETH_TX+: C136.1 J20.1(TD+) R162.1 U22.55(TXP)
ETH_TX-: C137.1 J20.2(TD-) R163.1 U22.56(TXN)
LED_LINK: J20.12(KG) LD12.1(C) U22.21(~{LNKA_LED}/GPIO1)
LED_SPEED: J20.14(KY) LD13.1(C) U22.22(~{SPD_LED}/GPIO2)
TR00: J20.7(VC1+) J24.2
TR01: J20.8(VC1-) J24.1
TR02: J20.9(VC2+) J24.4
TR03: J20.10(VC2-) J24.3
USB_HOST1_CTRL: U22.17(PRTCTL4) ; off-sheet USB_HOST1_CTRL
USB_HOST1_D+: U22.7(USBDP4) ; off-sheet USB_HOST1_D+
USB_HOST1_D-: U22.6(USBDM4) ; off-sheet USB_HOST1_D-
USB_HOST2_CTRL: U22.18(PRTCTL5) ; off-sheet USB_HOST2_CTRL
USB_HOST2_D+: U22.9(USBDP5) ; off-sheet USB_HOST2_D+
USB_HOST2_D-: U22.8(USBDM5) ; off-sheet USB_HOST2_D-
USB_HOST_INT_CTRL: U22.16(PRTCTL3) ; off-sheet USB_HOST_INT_CTRL
USB_HUB_D+: U22.59(USBDP0) ; off-sheet USB_HUB_D+
USB_HUB_D-: U22.58(USBDM0) ; off-sheet USB_HUB_D-
USB_INT+: U22.4(USBDP3) ; off-sheet USB_INT+
USB_INT-: U22.3(USBDM3) ; off-sheet USB_INT-
USB_mPCIE_D+: U22.2(USBDP2) ; off-sheet USB_mPCIE_D+
USB_mPCIE_D-: U22.1(USBDM2) ; off-sheet USB_mPCIE_D-
NetC135_1: C135.1 J20.3(CTD) R200.1
NetC147_1: C147.1 R204.1 U22.60(XO) Y2.1
NetC148_1: C148.1 R204.2 U22.61(XI) Y2.3
NetC187_2: C187.2 R205.1 U22.12(~{RESET})
NetJ20_11: J20.11(AG) R307.1
NetJ20_13: J20.13(AY) R308.2
NetLD12_2: LD12.2(A) R175.1
NetLD13_2: LD13.2(A) R174.1
NetLD14_1: LD14.1(C) U22.20(~{FDX_LED}/GPIO0)
NetLD14_2: LD14.2(A) R177.1
NetR169_1: R169.1 R171.2 U19.6(ORG)
NetR201_1: R201.1 U22.63(USBRBIAS)
NetR202_1: R202.1 U22.50(EXRES)
NetR203_1: R203.1 U22.41(AUTOMDIX_EN)
NetR206_1: R206.1 TP69.1(TP) U22.32(TCK)
NetR207_1: R207.1 TP67.1(TP) U22.30(TDI)
NetR208_1: R208.1 TP66.1(TP) U22.29(TMS)
NetR209_1: R209.1 TP65.1(TP) U22.28(~{TRST})
NetR212_1: R212.1 U22.11(VBUS_DET)
NetTP68_1: TP68.1(TP) U22.31(TDO)

Not connected (* = marked no-connect by the designer): U19 7(NC); U22 13(TEST1) 14(PRTCTL2) 35(GPIO3) 36(GPIO4) 37(GPIO5) 42(GPIO6) 43(GPIO7) 45(CLK24_OUT) 47(TEST4)

### Notes on the sheet
- (near R162) Near LAN9514
- (near C136) Near RJ45
- 4.7uF PIN38
- (in symbol EE - 93AA66CT-I-SN - 4Kb) EE
- (in symbol LED G - KPT-1608YC - 0603) G
- (in symbol LED V - GENERICO - 0603) V
- (in symbol MyFAEVuoto) Project; Page name; Board; Designer; Project Code; Customer; Internal Code; Code; Data; Rev.; Rev. changes; Sheet; /
- (in symbol RJ45-POE+ - 7499410213) 6
- (in symbol USB-ETH-HUBx4 - LAN9514I) ETH+USB HUB 4x

### Library data of the parts
C134 = CS-C-1206-10n/1kV: CHIP CAP.CER. 10nF 1000V 10% X7R 1206; MPN: Generic; Alternative MPN: GRM31CR73A103KW03L; Room: ETHERNET+HUB USB; Pkg Type: SMD; Mount: Yes
C135 = CS-C-0603-22n/50V: CHIP CAP.CER. 22nF 50V 10% X7R 0603; MPN: Generic; Room: ETHERNET+HUB USB; Pkg Type: SMD; Mount: Yes
C136-C139 = CS-C-0402-15p/50V-NP0: CHIP CAP.CER. 15pF 50V 5% NPO 0402; MPN: Generic; Pkg Type: SMD; Room: ETHERNET+HUB USB; Mount: Yes
C140 C170-C183 C186 = CS-C-0402-100n/16V: CHIP CAP.CER. 100nF 16V 10% X7R 0402; MPN: Generic; Alternative MPN: C0402C104K4RACTU; Room: ETHERNET+HUB USB; Pkg Type: SMD; Mount: Yes
C147 C148 = CS-C-0402-33p/50V-C0G: CHIP CAP.CER. 33pF 50V 5% C0G 0402; MPN: Generic; Room: ETHERNET+HUB USB; Pkg Type: SMD; Mount: Yes
C184 = CS-C-0402-4.7u/6V3-X5R: CHIP CAP.CER. 4.7uF 6.3V 20% X5R 0402; MPN: Generic; Pkg Type: SMD; Room: ETHERNET+HUB USB; Mount: Yes
C185 = CS-C-0402-1u/16-X5R: CHIP CAP.CER. 1uF 16V 10% X5R 0402; MPN: Generic; Pkg Type: SMD; Room: ETHERNET+HUB USB; Mount: Yes
C187 = CS-C-0402-10n/50V: CHIP CAP.CER. 10nF 50V 10% X7R 0402; MPN: Generic; Alternative MPN: C0402C103K5RACTU; Room: ETHERNET+HUB USB; Pkg Type: SMD; Mount: Yes
J20 = RJ45-POE+ - 7499410213: CONN JACK 1PORT 100 BASE-T PCB PoE+; Alternative MPN: TRJP4162HENL; Pkg Type: THT; Note: Cable clip bottom; Temperature range: -40°..+85°; MPN: 7499410213; Mount: Yes
J24 = STRIP-J-2X2-0254-MDS-TSM: CONN HEADER SMT 4POS 2.54MM DUAL ROW; MPN: Generic; Note: H=9.61mm; Pkg Type: SMD; Temperature range: -55°..+105°; Mount: Yes
L20 L21 = FIL-BLM18PG121SN1D-120R/2A: FERRITE BEAD 120 OHM 0603 1LN; Pkg Type: SMD; Room: ETHERNET+HUB USB; MPN: BLM18PG121SN1D; Mount: Yes
LD12 LD14 = LED V - GENERICO - 0603: LED Green 0603 SMT; Alternative MPN: KP-1608SGC; Pkg Type: SMD; Note: V=2.2V/20mA; Room: ETHERNET+HUB USB; MPN: Generic; Mount: Yes
LD13 = LED G - KPT-1608YC - 0603: LED Yellow 0603 SMT; MPN: Generic; Pkg Type: SMD; Note: V=2.1v/20mA; Room: ETHERNET+HUB USB; Alternative MPN: KPT-1608YC; Mount: Yes
R162-R165 = RS-0402-49.9r: CHIP RES. 49R9 0402 1/16W 1% 100PPM/°C; MPN: Generic; Pkg Type: SMD; Note: 100 ppm; Room: ETHERNET+HUB USB; Temperature range: -55°..+155°; Mount: Yes
R169 = RS-0402: CHIP RES. 0402; MPN: Generic; Pkg Type: SMD; Room: ETHERNET+HUB USB; Mount: No
R170 R203 R205-R209 = RS-0402-10k: CHIP RES. 10K 0402 1/16W 1%; MPN: Generic; Room: ETHERNET+HUB USB; Pkg Type: SMD; Temperature range: -55°..+125°; Mount: Yes
R171 = RS-0402-0r: CHIP RES. 0R 0402 1/16W 1%; MPN: Generic; Room: ETHERNET+HUB USB; Pkg Type: SMD; Mount: Yes
R174 R175 R177 R307 R308 = RS-0402-470r: CHIP RES. 470R 0402 1/16W 1%; MPN: Generic; Pkg Type: SMD; Room: ETHERNET+HUB USB; Mount: Yes
R200 = RS-0402-10r: CHIP RES. 10R 0402 1/16W 1% 100PPM/°C; MPN: Generic; Pkg Type: SMD; Note: 100 ppm; Room: ETHERNET+HUB USB; Temperature range: -55°..+125°; Mount: Yes
R201 = RS-0402-12k: CHIP RES. 12K 0402 1/16W 1%; MPN: Generic; Room: ETHERNET+HUB USB; Pkg Type: SMD; Mount: Yes
R202 = RS-0402-12.4k: CHIP RES. 12K4 0402 1/16W 1% 100PPM/°C; MPN: Generic; Room: ETHERNET+HUB USB; Note: 100ppm; Pkg Type: SMD; Mount: Yes
R204 = RS-0402-1M: CHIP RES. 1M 0402 1/16W 1%; MPN: Generic; Room: ETHERNET+HUB USB; Pkg Type: SMD; Mount: Yes
R212 = RS-0402-1k: CHIP RES. 1K 0402 1/16W 1%; MPN: Generic; Pkg Type: SMD; Room: ETHERNET+HUB USB; Mount: Yes
TP65-TP69 = TEST POINT SMD 1 MM: TEST POINT SMD; MPN: TP-No-BoM; Room: ETHERNET+HUB USB; Pkg Type: SMD; Mount: Yes
U19 = EE - 93AA66CT-I-SN - 4Kb: IC EEPROM 4KBIT SPI 3MHZ 8SOIC; Pkg Type: SMD; Note: VIH=2V - VIL=0.8V - VOL=0.4; Room: ETHERNET+HUB USB; Temperature range: -40°..+85°; MPN: 93AA66CT-I/SN; Mount: Yes
U22 = USB-ETH-HUBx4 - LAN9514I: IC USB 2.0 ETH CTLR IND 64-QFN; Pkg Type: SMD; Note: USB 2.0 + ETH 10/100; Temperature range: -40°..+85°; MPN: LAN9514I-JZX; Mount: Yes
Y2 = QUARZO-ABM8G-25.000MHz: 25MHz ±20ppm Crystal 18pF 60 Ohms 4-SMD, No Lead  D=3.2x2.5; MPN: ABM8G-25.000MHZ- 18-D2Y-T; Pkg Type: SMD; Room: ETHERNET+HUB USB; Mount: Yes
*#10 = MyFAEVuoto: Page Number: 11; Page Count: 11; Customer Code: -; Database: -